# Altium project NB3000AL.PRJPCB (part 2 of 3)

## Sheet FPGA_NonIO.SchDoc: User FPGA Pwr and Programming
size A3; Organization: Altium Limited.; Address1: Level 3, 12a Rodborough Rd; Address2: Frenchs Forest 2086; Address3: NSW; Address4: AUSTRALIA; DocumentNumber: 8; SheetNumber: 9; SheetTotal: 78
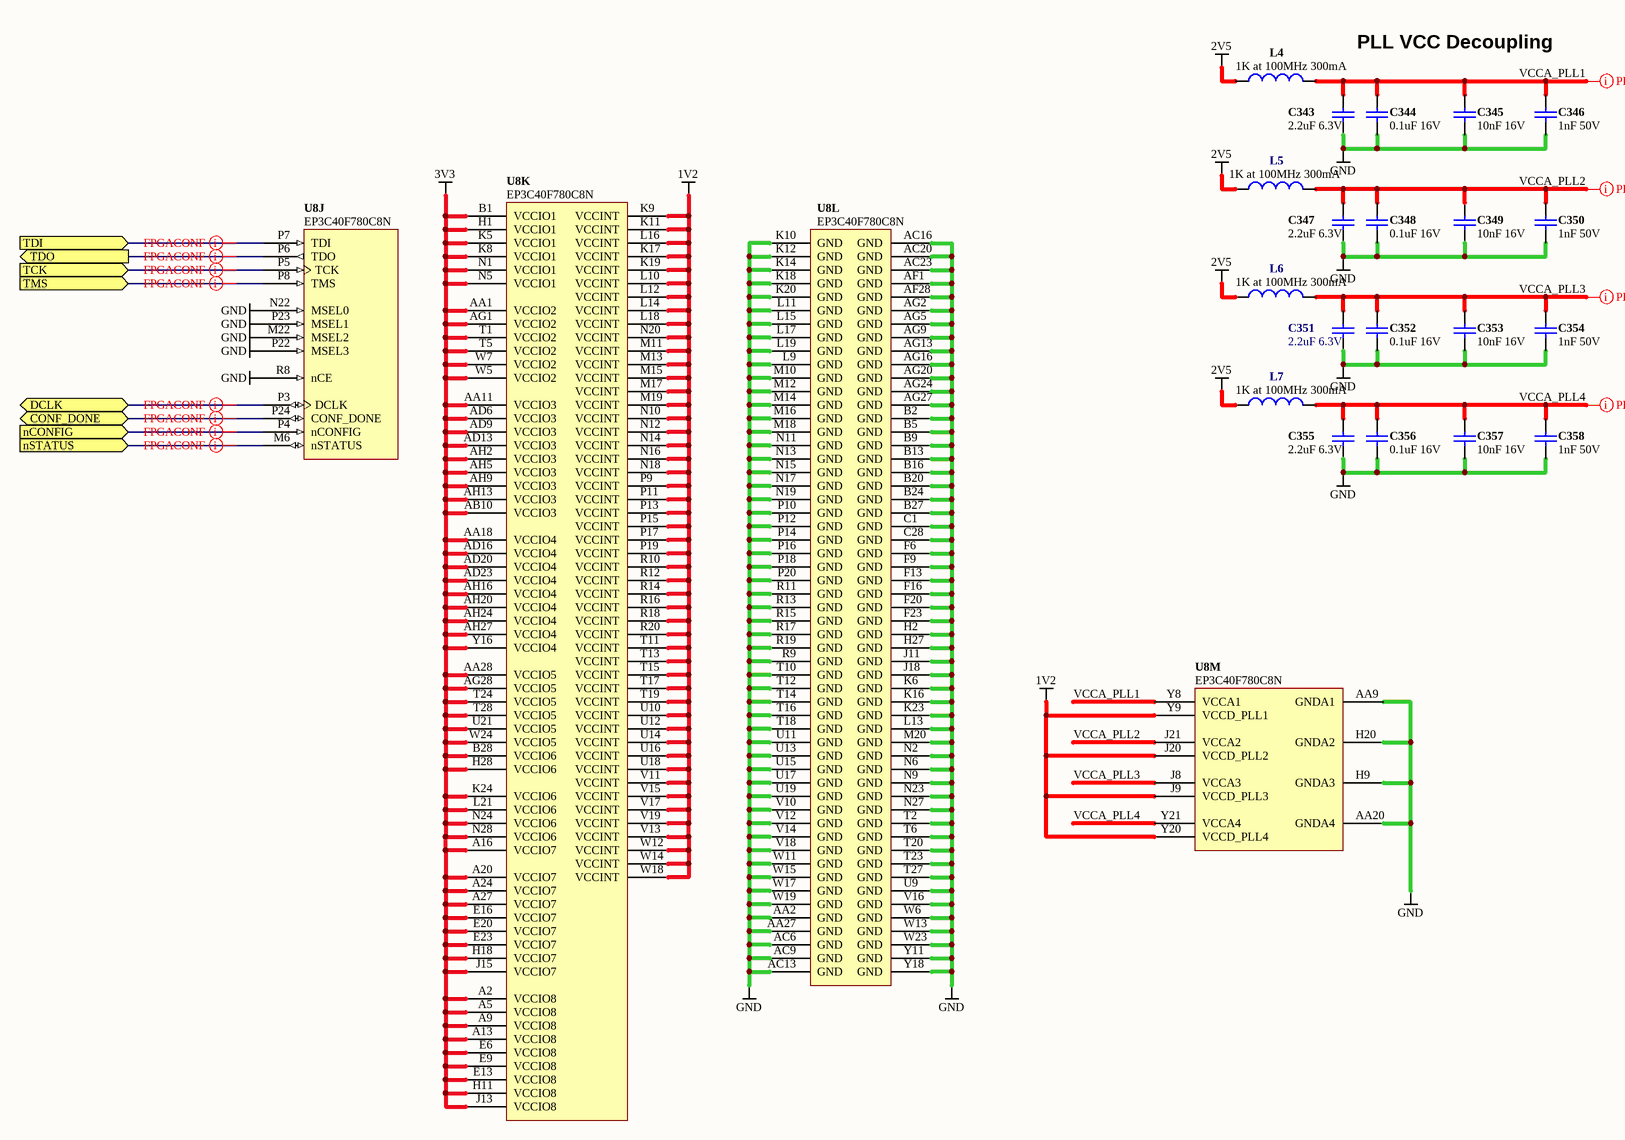
[diagram p10: FPGA_NonIO.SchDoc]

### Parts
(Parts that share a designator on the sheet are numbered #1, #2 ... from top to bottom, then left to right.)
C343#1  2.2uF 6.3V  [CAPC1005-STAR]
C344#1  0.1uF 16V  [CAPC1005-STAR]
C345#1  10nF 16V  [CAPC1005-STAR]
C346  1nF 50V  [CAPC1005-STAR]
C347  2.2uF 6.3V  [CAPC1005-STAR]
C348  0.1uF 16V  [CAPC1005-STAR]
C349  10nF 16V  [CAPC1005-STAR]
C350  1nF 50V  [CAPC1005-STAR]
C351  2.2uF 6.3V  [CAPC1005-STAR]
C352  0.1uF 16V  [CAPC1005-STAR]
C353  10nF 16V  [CAPC1005-STAR]
C354  1nF 50V  [CAPC1005-STAR]
C355  2.2uF 6.3V  [CAPC1005-STAR]
C356  0.1uF 16V  [CAPC1005-STAR]
C357  10nF 16V  [CAPC1005-STAR]
C358  1nF 50V  [CAPC1005-STAR]
L4  1K at 100MHz 300mA  [INDC1005]
L5  1K at 100MHz 300mA  [INDC1005]
L6  1K at 100MHz 300mA  [INDC1005]
L7  1K at 100MHz 300mA  [INDC1005]
U8  EP3C40F780C8N  [FBGA780-2]  (parts J,K,L,M of 13)

### Ports
CONF_DONE (bidir), DCLK (bidir), nCONFIG (in), nSTATUS (in), TCK (in), TDI (in), TDO (out), TMS (in)

### Nets
1V2: U8.J9(VCCD_PLL3) U8.J20(VCCD_PLL2) U8.K9(VCCINT) U8.K11(VCCINT) U8.K17(VCCINT) U8.K19(VCCINT) U8.L10(VCCINT) U8.L12(VCCINT) U8.L14(VCCINT) U8.L16(VCCINT) U8.L18(VCCINT) U8.M11(VCCINT) U8.M13(VCCINT) U8.M15(VCCINT) U8.M17(VCCINT) U8.M19(VCCINT) U8.N10(VCCINT) U8.N12(VCCINT) U8.N14(VCCINT) U8.N16(VCCINT) U8.N18(VCCINT) U8.N20(VCCINT) U8.P9(VCCINT) U8.P11(VCCINT) U8.P13(VCCINT) U8.P15(VCCINT) U8.P17(VCCINT) U8.P19(VCCINT) U8.R10(VCCINT) U8.R12(VCCINT) U8.R14(VCCINT) U8.R16(VCCINT) U8.R18(VCCINT) U8.R20(VCCINT) U8.T11(VCCINT) U8.T13(VCCINT) U8.T15(VCCINT) U8.T17(VCCINT) U8.T19(VCCINT) U8.U10(VCCINT) U8.U12(VCCINT) U8.U14(VCCINT) U8.U16(VCCINT) U8.U18(VCCINT) U8.V11(VCCINT) U8.V13(VCCINT) U8.V15(VCCINT) U8.V17(VCCINT) U8.V19(VCCINT) U8.W12(VCCINT) U8.W14(VCCINT) U8.W18(VCCINT) U8.Y9(VCCD_PLL1) U8.Y20(VCCD_PLL4)
2V5: L4.1 L5.1 L6.1 L7.1
3V3: U8.A2(VCCIO8) U8.A5(VCCIO8) U8.A9(VCCIO8) U8.A13(VCCIO8) U8.A16(VCCIO7) U8.A20(VCCIO7) U8.A24(VCCIO7) U8.A27(VCCIO7) U8.AA1(VCCIO2) U8.AA11(VCCIO3) U8.AA18(VCCIO4) U8.AA28(VCCIO5) U8.AB10(VCCIO3) U8.AD6(VCCIO3) U8.AD9(VCCIO3) U8.AD13(VCCIO3) U8.AD16(VCCIO4) U8.AD20(VCCIO4) U8.AD23(VCCIO4) U8.AG1(VCCIO2) U8.AG28(VCCIO5) U8.AH2(VCCIO3) U8.AH5(VCCIO3) U8.AH9(VCCIO3) U8.AH13(VCCIO3) U8.AH16(VCCIO4) U8.AH20(VCCIO4) U8.AH24(VCCIO4) U8.AH27(VCCIO4) U8.B1(VCCIO1) U8.B28(VCCIO6) U8.E6(VCCIO8) U8.E9(VCCIO8) U8.E13(VCCIO8) U8.E16(VCCIO7) U8.E20(VCCIO7) U8.E23(VCCIO7) U8.H1(VCCIO1) U8.H11(VCCIO8) U8.H18(VCCIO7) U8.H28(VCCIO6) U8.J13(VCCIO8) U8.J15(VCCIO7) U8.K5(VCCIO1) U8.K8(VCCIO1) U8.K24(VCCIO6) U8.L21(VCCIO6) U8.N1(VCCIO1) U8.N5(VCCIO1) U8.N24(VCCIO6) U8.N28(VCCIO6) U8.T1(VCCIO2) U8.T5(VCCIO2) U8.T24(VCCIO5) U8.T28(VCCIO5) U8.U21(VCCIO5) U8.W5(VCCIO2) U8.W7(VCCIO2) U8.W24(VCCIO5) U8.Y16(VCCIO4)
GND: C343#1.2 C344#1.2 C345#1.2 C346.2 C347.2 C348.2 C349.2 C350.2 C351.2 C352.2 C353.2 C354.2 C355.2 C356.2 C357.2 C358.2 U8.AA2(GND) U8.AA9(GNDA1) U8.AA20(GNDA4) U8.AA27(GND) U8.AC6(GND) U8.AC9(GND) U8.AC13(GND) U8.AC16(GND) U8.AC20(GND) U8.AC23(GND) U8.AF1(GND) U8.AF28(GND) U8.AG2(GND) U8.AG5(GND) U8.AG9(GND) U8.AG13(GND) U8.AG16(GND) U8.AG20(GND) U8.AG24(GND) U8.AG27(GND) U8.B2(GND) U8.B5(GND) U8.B9(GND) U8.B13(GND) U8.B16(GND) U8.B20(GND) U8.B24(GND) U8.B27(GND) U8.C1(GND) U8.C28(GND) U8.F6(GND) U8.F9(GND) U8.F13(GND) U8.F16(GND) U8.F20(GND) U8.F23(GND) U8.H2(GND) U8.H9(GNDA3) U8.H20(GNDA2) U8.H27(GND) U8.J11(GND) U8.J18(GND) U8.K6(GND) U8.K10(GND) U8.K12(GND) U8.K14(GND) U8.K16(GND) U8.K18(GND) U8.K20(GND) U8.K23(GND) U8.L9(GND) U8.L11(GND) U8.L13(GND) U8.L15(GND) U8.L17(GND) U8.L19(GND) U8.M10(GND) U8.M12(GND) U8.M14(GND) U8.M16(GND) U8.M18(GND) U8.M20(GND) U8.M22(MSEL2) U8.N2(GND) U8.N6(GND) U8.N9(GND) U8.N11(GND) U8.N13(GND) U8.N15(GND) U8.N17(GND) U8.N19(GND) U8.N22(MSEL0) U8.N23(GND) U8.N27(GND) U8.P10(GND) U8.P12(GND) U8.P14(GND) U8.P16(GND) U8.P18(GND) U8.P20(GND) U8.P22(MSEL3) U8.P23(MSEL1) U8.R8(nCE) U8.R9(GND) U8.R11(GND) U8.R13(GND) U8.R15(GND) U8.R17(GND) U8.R19(GND) U8.T2(GND) U8.T6(GND) U8.T10(GND) U8.T12(GND) U8.T14(GND) U8.T16(GND) U8.T18(GND) U8.T20(GND) U8.T23(GND) U8.T27(GND) U8.U9(GND) U8.U11(GND) U8.U13(GND) U8.U15(GND) U8.U17(GND) U8.U19(GND) U8.V10(GND) U8.V12(GND) U8.V14(GND) U8.V16(GND) U8.V18(GND) U8.W6(GND) U8.W11(GND) U8.W13(GND) U8.W15(GND) U8.W17(GND) U8.W19(GND) U8.W23(GND) U8.Y11(GND) U8.Y18(GND)
CONF_DONE: U8.P24(CONF_DONE) ; port CONF_DONE
DCLK: U8.P3(DCLK) ; port DCLK
nCONFIG: U8.P4(nCONFIG) ; port nCONFIG
nSTATUS: U8.M6(nSTATUS) ; port nSTATUS
TCK: U8.P5(TCK) ; port TCK
TDI: U8.P7(TDI) ; port TDI
TDO: U8.P6(TDO) ; port TDO
TMS: U8.P8(TMS) ; port TMS
VCCA_PLL1: C343#1.1 C344#1.1 C345#1.1 C346.1 L4.2 U8.Y8(VCCA1)
VCCA_PLL2: C347.1 C348.1 C349.1 C350.1 L5.2 U8.J21(VCCA2)
VCCA_PLL3: C351.1 C352.1 C353.1 C354.1 L6.2 U8.J8(VCCA3)
VCCA_PLL4: C355.1 C356.1 C357.1 C358.1 L7.2 U8.Y21(VCCA4)

### Layout directives
net class FPGACONF: CONF_DONE, DCLK, nCONFIG, nSTATUS, TCK, TDI, TDO, TMS
net class PLL: VCCA_PLL1, VCCA_PLL2, VCCA_PLL3, VCCA_PLL4

### Notes on the sheet
- PLL VCC Decoupling
- Sheet Title
- Project Title
- Size:
- Date:
- A3
- Assy:
- Time:
- Revision:
- Sheet
- of
- File:

### Library data of the parts
C343#1 C347 C351 C355 = D-101-0112: Capacitor, Ceramic, 2.2uF 10% 6.3V 0402 (1005) X5R; Polarity: Non-Polarized; Tolerance: 20 %; Capacitance: 2.2 uF; Dielectric: X5R; Mounting Technology: Surface Mount; Rated Voltage: 6.3 V; Status: Unreleased; Technology: None; Category: Capacitor
C344#1 C348 C352 C356 = D-101-0080: Capacitor, Ceramic, 0.1uF 10% 16V 0402 (1005) X7R; Polarity: Non-Polarized; Capacitance: 0.1 uF; Dielectric: X7R; Mounting Technology: Surface Mount; Rated Voltage: 16 V; Status: Production; Technology: Ceramic; Tolerance: 10 %; Category: Capacitor
C345#1 C349 C353 C357 = D-101-0077: Capacitor, Ceramic, 10nF 10% 16V 0402 (1005) X7R; Polarity: Non-Polarized; Capacitance: 10 nF; Dielectric: X7R; Mounting Technology: Surface Mount; Rated Voltage: 16 V; Status: Production; Technology: Ceramic; Tolerance: 10 %; Category: Capacitor
C346 C350 C354 C358 = D-101-0030: Capacitor, Ceramic, 1nF 10% 50V 0402 (1005) X7R; Polarity: Non-Polarized; Capacitance: 1 nF; Dielectric: X7R; Mounting Technology: Surface Mount; Rated Voltage: 50 V; Status: Production; Technology: Ceramic; Tolerance: 10 %; Category: Capacitor
L4-L7 = D-102-0026: Inductor, Ferrite Bead 1K@100MHz 300mA 0402 BK1005HS102-T; Inductance: nH; Max Input Current: 300 mA; Mounting Technology: Surface Mount; Status: Production; Category: Inductor
U8 = D-241-0023: FPGA, Altera Cyclone3-40 F780; Supply Voltage: mV; Mounting Technology: Surface Mount; Status: Unreleased; Technology: None; Category: IC-FPGA

## Sheet PULLDNx3.SCHDOC: Visual Indicators Top
size A4; DocumentNumber: 10; SheetNumber: 11; SheetTotal: 78
Used 10 times, as channels PULLDOWN, PULLDOWN, PULLDOWN, PULLDOWN, PULLDOWN, PULLDOWN, PULLDOWN, PULLDOWN, PULLDOWN, PULLDOWN. Parts and nets are listed once, with the designators drawn on the sheet.
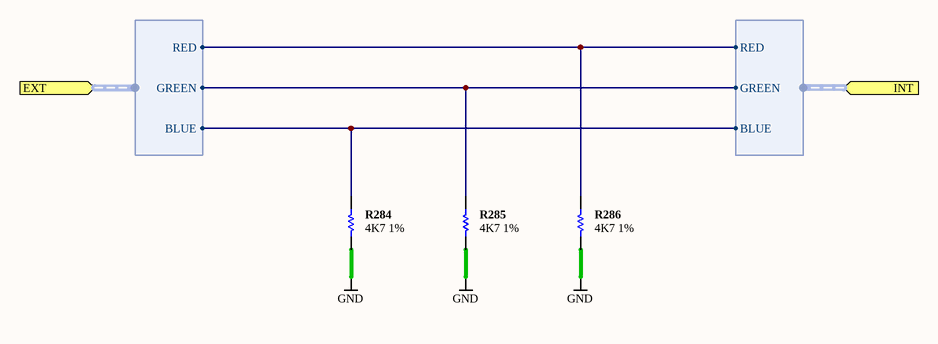
[diagram p11: PULLDNx3.SCHDOC]

### Parts
R284  4K7 1%  [RESC1005-STAR]
R285  4K7 1%  [RESC1005-STAR]
R286  4K7 1%  [RESC1005-STAR]

### Ports
EXT (harness RGB_LED), INT (harness RGB_LED)

### Harnesses
RGB_LED: GREEN, RED, BLUE

### Nets
GND: R284.1 R285.1 R286.1
NetR284_2: R284.2 ; port EXT.BLUE, port INT.BLUE
NetR285_2: R285.2 ; port EXT.GREEN, port INT.GREEN
NetR286_2: R286.2 ; port EXT.RED, port INT.RED

### Channels
PULLDOWN: designators end in A
PULLDOWN: designators end in B
PULLDOWN: designators end in C
PULLDOWN: designators end in D
PULLDOWN: designators end in E
PULLDOWN: designators end in F
PULLDOWN: designators end in G
PULLDOWN: designators end in H
PULLDOWN: designators end in I
PULLDOWN: designators end in J

### Notes on the sheet
- Sheet Title
- Project Title
- Size:
- Date:
- A4
- Assy:
- Time:
- Revision:
- Sheet
- of
- File:

### Library data of the parts
R284-R286 = D-100-0088: Resistor, 4K7 1% 0402 (1005); Power Rating: 63 mW; Resistance: 4.7 K; Category: Resistor; Mounting Technology: Surface Mount; Status: Production; Tolerance: 1 %

## Sheet LED_RGB_SMDx8.SCHDOC: Visual Indicators Top
size A4; DocumentNumber: 10; SheetNumber: 11; SheetTotal: 78
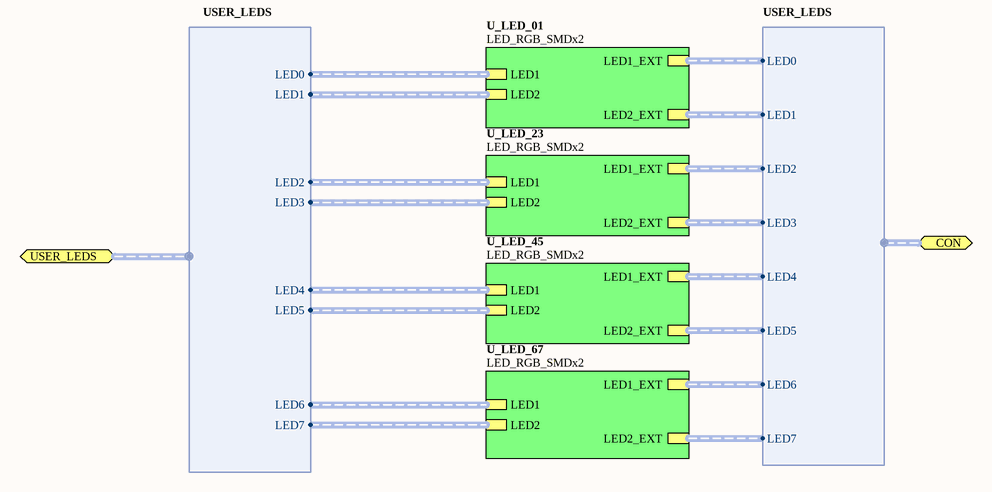
[diagram p12: LED_RGB_SMDx8.SCHDOC]

### Sub-sheets
U_LED_01 = LED_RGB_SMDx2: LED1 (harness RGB_LED), LED2 (harness RGB_LED), LED1_EXT (harness RGB_LED), LED2_EXT (harness RGB_LED)
U_LED_23 = LED_RGB_SMDx2: LED1 (harness RGB_LED), LED2 (harness RGB_LED), LED1_EXT (harness RGB_LED), LED2_EXT (harness RGB_LED)
U_LED_45 = LED_RGB_SMDx2: LED1 (harness RGB_LED), LED2 (harness RGB_LED), LED1_EXT (harness RGB_LED), LED2_EXT (harness RGB_LED)
U_LED_67 = LED_RGB_SMDx2: LED1 (harness RGB_LED), LED2 (harness RGB_LED), LED1_EXT (harness RGB_LED), LED2_EXT (harness RGB_LED)

### Ports
CON (harness USER_LEDS), USER_LEDS (harness USER_LEDS)

### Harnesses
USER_LEDS: LED0, LED1, LED2, LED3, LED4, LED5, LED6, LED7

### Notes on the sheet
- Sheet Title
- Project Title
- Size:
- Date:
- A4
- Assy:
- Time:
- Revision:
- Sheet
- of
- File:

## Sheet LED_RGB_SMDx2.SCHDOC: Visual Indicators
size A4; DocumentNumber: 1; SheetNumber: 2; SheetTotal: 77
Used 4 times, as channels U_LED_01, U_LED_23, U_LED_45, U_LED_67. Parts and nets are listed once, with the designators drawn on the sheet.
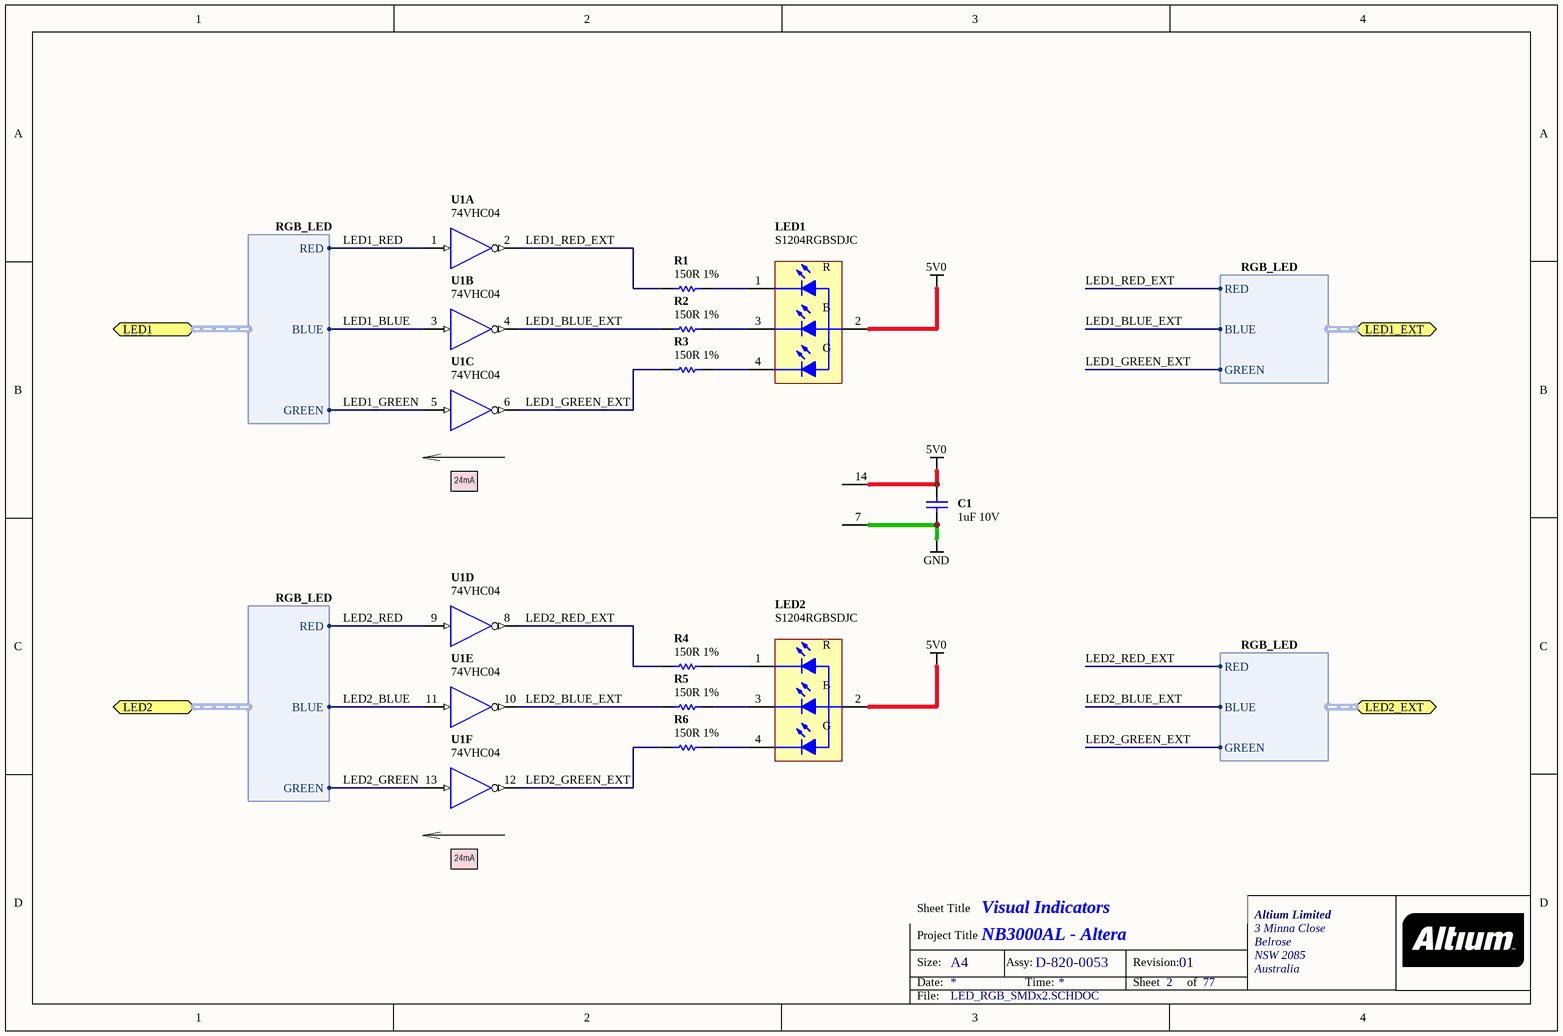
[diagram p13: LED_RGB_SMDx2.SCHDOC]

### Parts
C1  1uF 10V  [CAPC1005-STAR]
LED1  S1204RGBSDJC  [S1204RGBSDJC]
LED2  S1204RGBSDJC  [S1204RGBSDJC]
R1  150R 1%  [RESC1005-STAR]
R2  150R 1%  [RESC1005-STAR]
R3  150R 1%  [RESC1005-STAR]
R4  150R 1%  [RESC1005-STAR]
R5  150R 1%  [RESC1005-STAR]
R6  150R 1%  [RESC1005-STAR]
U1  74VHC04  [TSSOP14]  (parts A,B,C,D,E,F of 6)

### Ports
LED1 (harness RGB_LED), LED1_EXT (harness RGB_LED), LED2 (harness RGB_LED), LED2_EXT (harness RGB_LED)

### Harnesses
RGB_LED: GREEN, RED, BLUE

### Nets
5V0: C1.2 LED1.2(A2) LED2.2(A2) U1.14(VCC)
GND: C1.1 U1.7(GND)
LED1_BLUE: U1.3(A) ; port LED1.BLUE
LED1_BLUE_EXT: R2.2 U1.4(Y) ; port LED1_EXT.BLUE
LED1_GREEN: U1.5(A) ; port LED1.GREEN
LED1_GREEN_EXT: R3.2 U1.6(Y) ; port LED1_EXT.GREEN
LED1_RED: U1.1(A) ; port LED1.RED
LED1_RED_EXT: R1.2 U1.2(Y) ; port LED1_EXT.RED
LED2_BLUE: U1.11(A) ; port LED2.BLUE
LED2_BLUE_EXT: R5.2 U1.10(Y) ; port LED2_EXT.BLUE
LED2_GREEN: U1.13(A) ; port LED2.GREEN
LED2_GREEN_EXT: R6.2 U1.12(Y) ; port LED2_EXT.GREEN
LED2_RED: U1.9(A) ; port LED2.RED
LED2_RED_EXT: R4.2 U1.8(Y) ; port LED2_EXT.RED
NetLED1_1: LED1.1(R) R1.1
NetLED1_3: LED1.3(B) R2.1
NetLED1_4: LED1.4(G) R3.1
NetLED2_1: LED2.1(R) R4.1
NetLED2_3: LED2.3(B) R5.1
NetLED2_4: LED2.4(G) R6.1

### Channels
U_LED_01: designators end in A
U_LED_23: designators end in B
U_LED_45: designators end in C
U_LED_67: designators end in D

### Notes on the sheet
- (near U1) 24mA
- 24mA
- Sheet Title
- Project Title
- Size:
- Date:
- A4
- Assy:
- Time:
- Revision:
- Sheet
- of
- File:

### Library data of the parts
C1 = D-101-0131: Capacitor, Ceramic, 1uF 10% 10V 0402 (1005) X5R; Polarity: Non-Polarized; Category: Capacitor; Capacitance: 1 uF; Dielectric: X5R; Mounting Technology: Surface Mount; Rated Voltage: 10 V; Status: Unreleased; Technology: None; Tolerance: 10 %
LED1 LED2 = D-153-0020: SASEN LED, RGB, SMD; Brightness: mcd; Peak Wave Length: nm; Color: RGB; Mounting Technology: Surface Mount; Status: Production; Category: LED
R1-R6 = D-100-0005: Resistor, 150R 1% 0402 (1005); Power Rating: 63 mW; Category: Resistor; Mounting Technology: Surface Mount; Resistance: 150 R; Status: Unreleased; Tolerance: 1 %
U1 = D-205-0004: HEX Inverter; Mounting Technology: Surface Mount; Status: Unreleased; Category: IC-Logic

## Sheet PWJACK+SWITCH.SchDoc: Power Jack & Switch
size A4; Organization: Altium Limited.; Address1: Level 3, 12a Rodborough Rd; Address2: Frenchs Forest 2086; Address3: NSW; Address4: AUSTRALIA; DocumentNumber: 20; Revision: 6; SheetNumber: 21; SheetTotal: 78
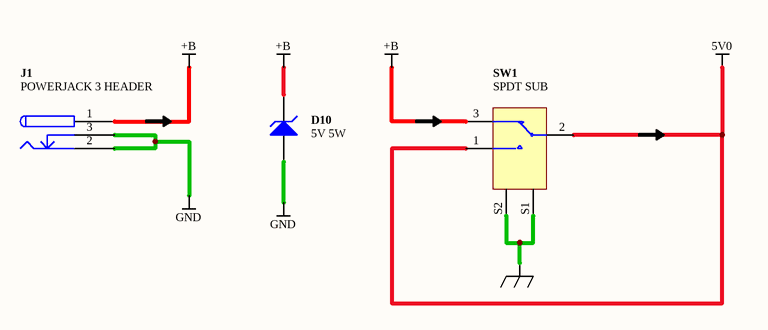
[diagram p14: PWJACK+SWITCH.SchDoc]

### Parts
(Parts that share a designator on the sheet are numbered #1, #2 ... from top to bottom, then left to right.)
D10  5V 5W  [DIOM8059]
J1#2  POWERJACK 3 HEADER  [KLD-0202]
SW1  SPDT SUB  [T8019L-TNQ]

### Nets
5V0: SW1.1 SW1.2
+B: D10.2(K) J1#2.1 SW1.3
GND: D10.1(A) J1#2.2 J1#2.3
SHIELD: SW1.S1 SW1.S2

### Notes on the sheet
- Sheet Title
- Project Title
- Size:
- Date:
- A4
- Assy:
- Time:
- Revision:
- Sheet
- of
- File:

### Library data of the parts
D10 = D-150-0001: Zener Diode, 5V 5W; Max Forward Current: mA; Rated Voltage: mV; Category: Diode-Zener; Mounting Technology: Surface Mount; Status: Production
J1#2 = D-300-0007: Connector, 3 Conductor Power Jack 2 break 2 aux contacts; ClassName: COMP_5V0; Category: Connector; Connector type: POWERJACK 3 HEADER; Status: Production
SW1 = D-301-0000: Switch, SPDT Subminiature Toggle; ClassName: COMP_5V0; Category: Switch; Status: Production

## Sheet HOST_JTAG.SchDoc: Local MCU Debug Connector
size A4; DocumentNumber: 24; SheetNumber: 25; SheetTotal: 78
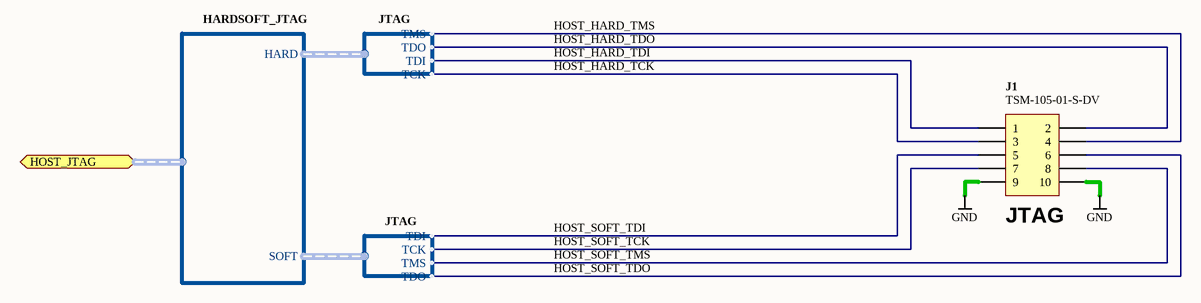
[diagram p15: HOST_JTAG.SchDoc]

### Parts
(Parts that share a designator on the sheet are numbered #1, #2 ... from top to bottom, then left to right.)
J1#3  TSM-105-01-S-DV  [TSM-105-01-DV]

### Ports
HOST_JTAG (harness HARDSOFT_JTAG)

### Harnesses
JTAG: TMS, TDO, TDI, TCK
HARDSOFT_JTAG: HARD, SOFT

### Nets
GND: J1#3.9 J1#3.10
HOST_HARD_TCK: J1#3.3 ; harness JTAG.TCK
HOST_HARD_TDI: J1#3.1 ; harness JTAG.TDI
HOST_HARD_TDO: J1#3.2 ; harness JTAG.TDO
HOST_HARD_TMS: J1#3.4 ; harness JTAG.TMS
HOST_SOFT_TCK: J1#3.7 ; harness JTAG.TCK
HOST_SOFT_TDI: J1#3.5 ; harness JTAG.TDI
HOST_SOFT_TDO: J1#3.6 ; harness JTAG.TDO
HOST_SOFT_TMS: J1#3.8 ; harness JTAG.TMS

### Notes on the sheet
- (near J1#3) JTAG
- Sheet Title
- Project Title
- Size:
- Date:
- A4
- Assy:
- Time:
- Revision:
- Sheet
- of
- File:

### Library data of the parts
J1#3 = D-300-0076: Non-Boxed Header IDC, 2 X 5 Pin SMD; Connector type: Boxed; Max Current: mA; Category: Connector; Mounting Technology: Surface Mount; Status: Unreleased

## Sheet USERPWR.SchDoc: USER IO Power Loopback
size A4; Organization: Altium Limited.
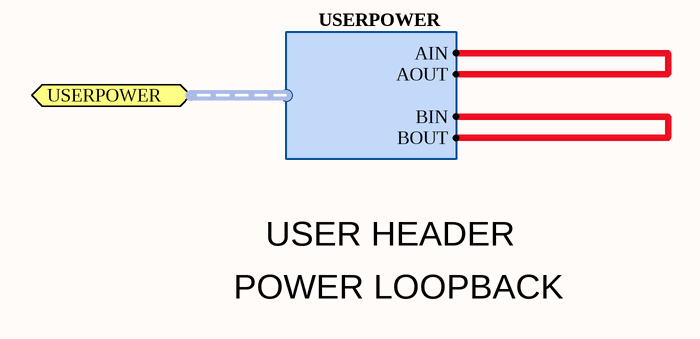
[diagram p16: USERPWR.SchDoc]

### Ports
USERPOWER (harness USERPOWER)

### Harnesses
USERPOWER: AIN, BIN, AOUT, BOUT

### Nets
(unnamed): port USERPOWER.AIN, port USERPOWER.AOUT
(unnamed): port USERPOWER.BIN, port USERPOWER.BOUT

### Notes on the sheet
- POWER LOOPBACK
- USER HEADER
- Sheet Title
- Project Title
- Size:
- Date:
- A4
- Assy:
- Time:
- Revision:
- Sheet
- of
- File:

## Sheet Host_FPGA.SchDoc: Host Controller - Altera - EP3C10
size A2; Organization: Altium Limited.; Revision: 6; PageSetup: Record=PageOptions|CenterHorizontal=True|CenterVertical=True|PrintScale=0.47|XCorrection=1.00|YCorrection=1.00|PrintKind=0|BorderSize=5000000|LeftOffset=0|BottomOffset=0|Orientation=2|PaperLength=1000|PaperWidth=1000|Scale=100|PaperSource=7|PrintQuality=1200|MediaType=1|DitherType=10|PaperKind=A4 (210 x 297 mm)|PrintScaleMode=1
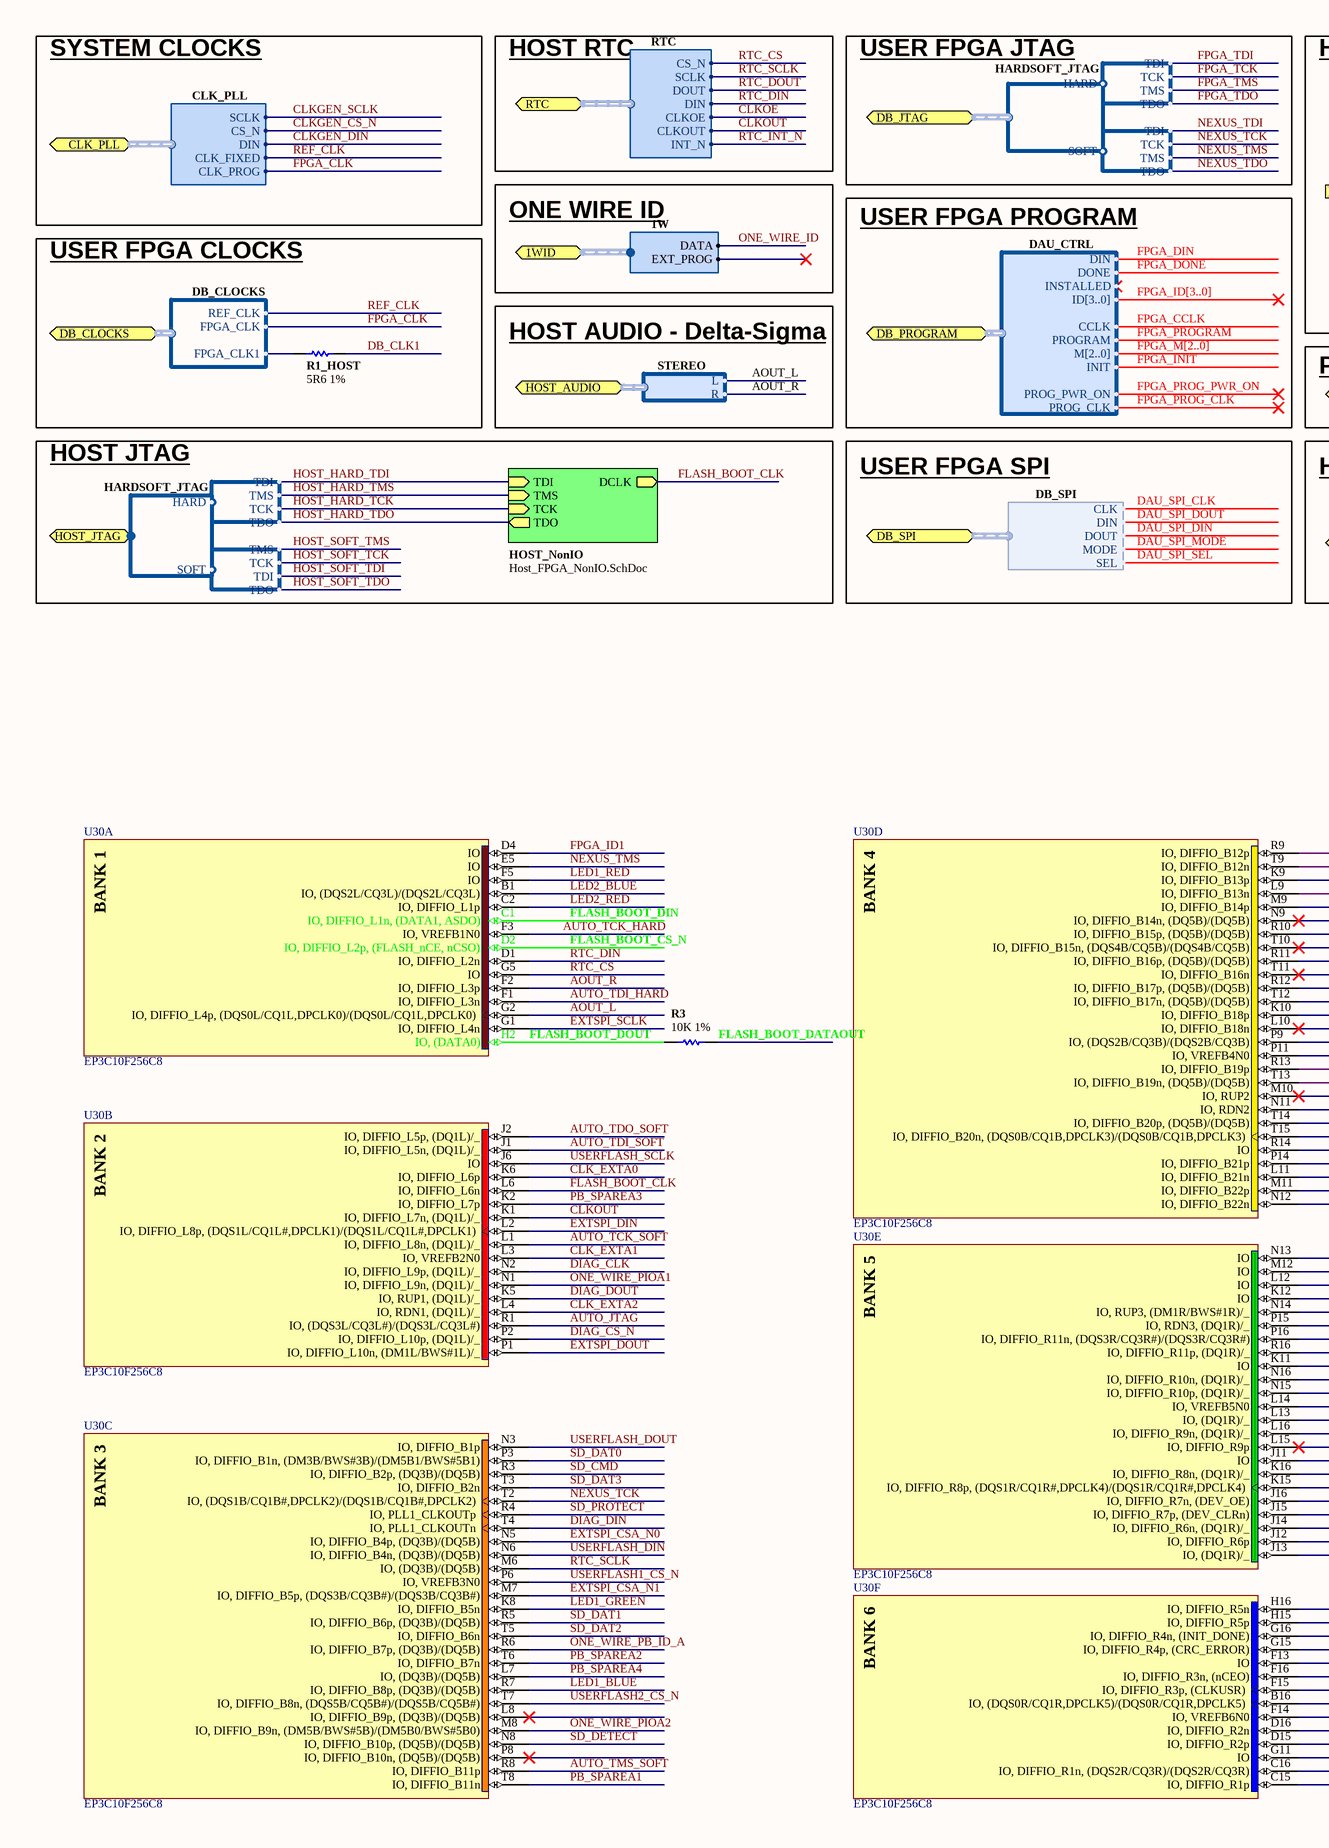
[diagram p17: Host_FPGA.SchDoc, left]
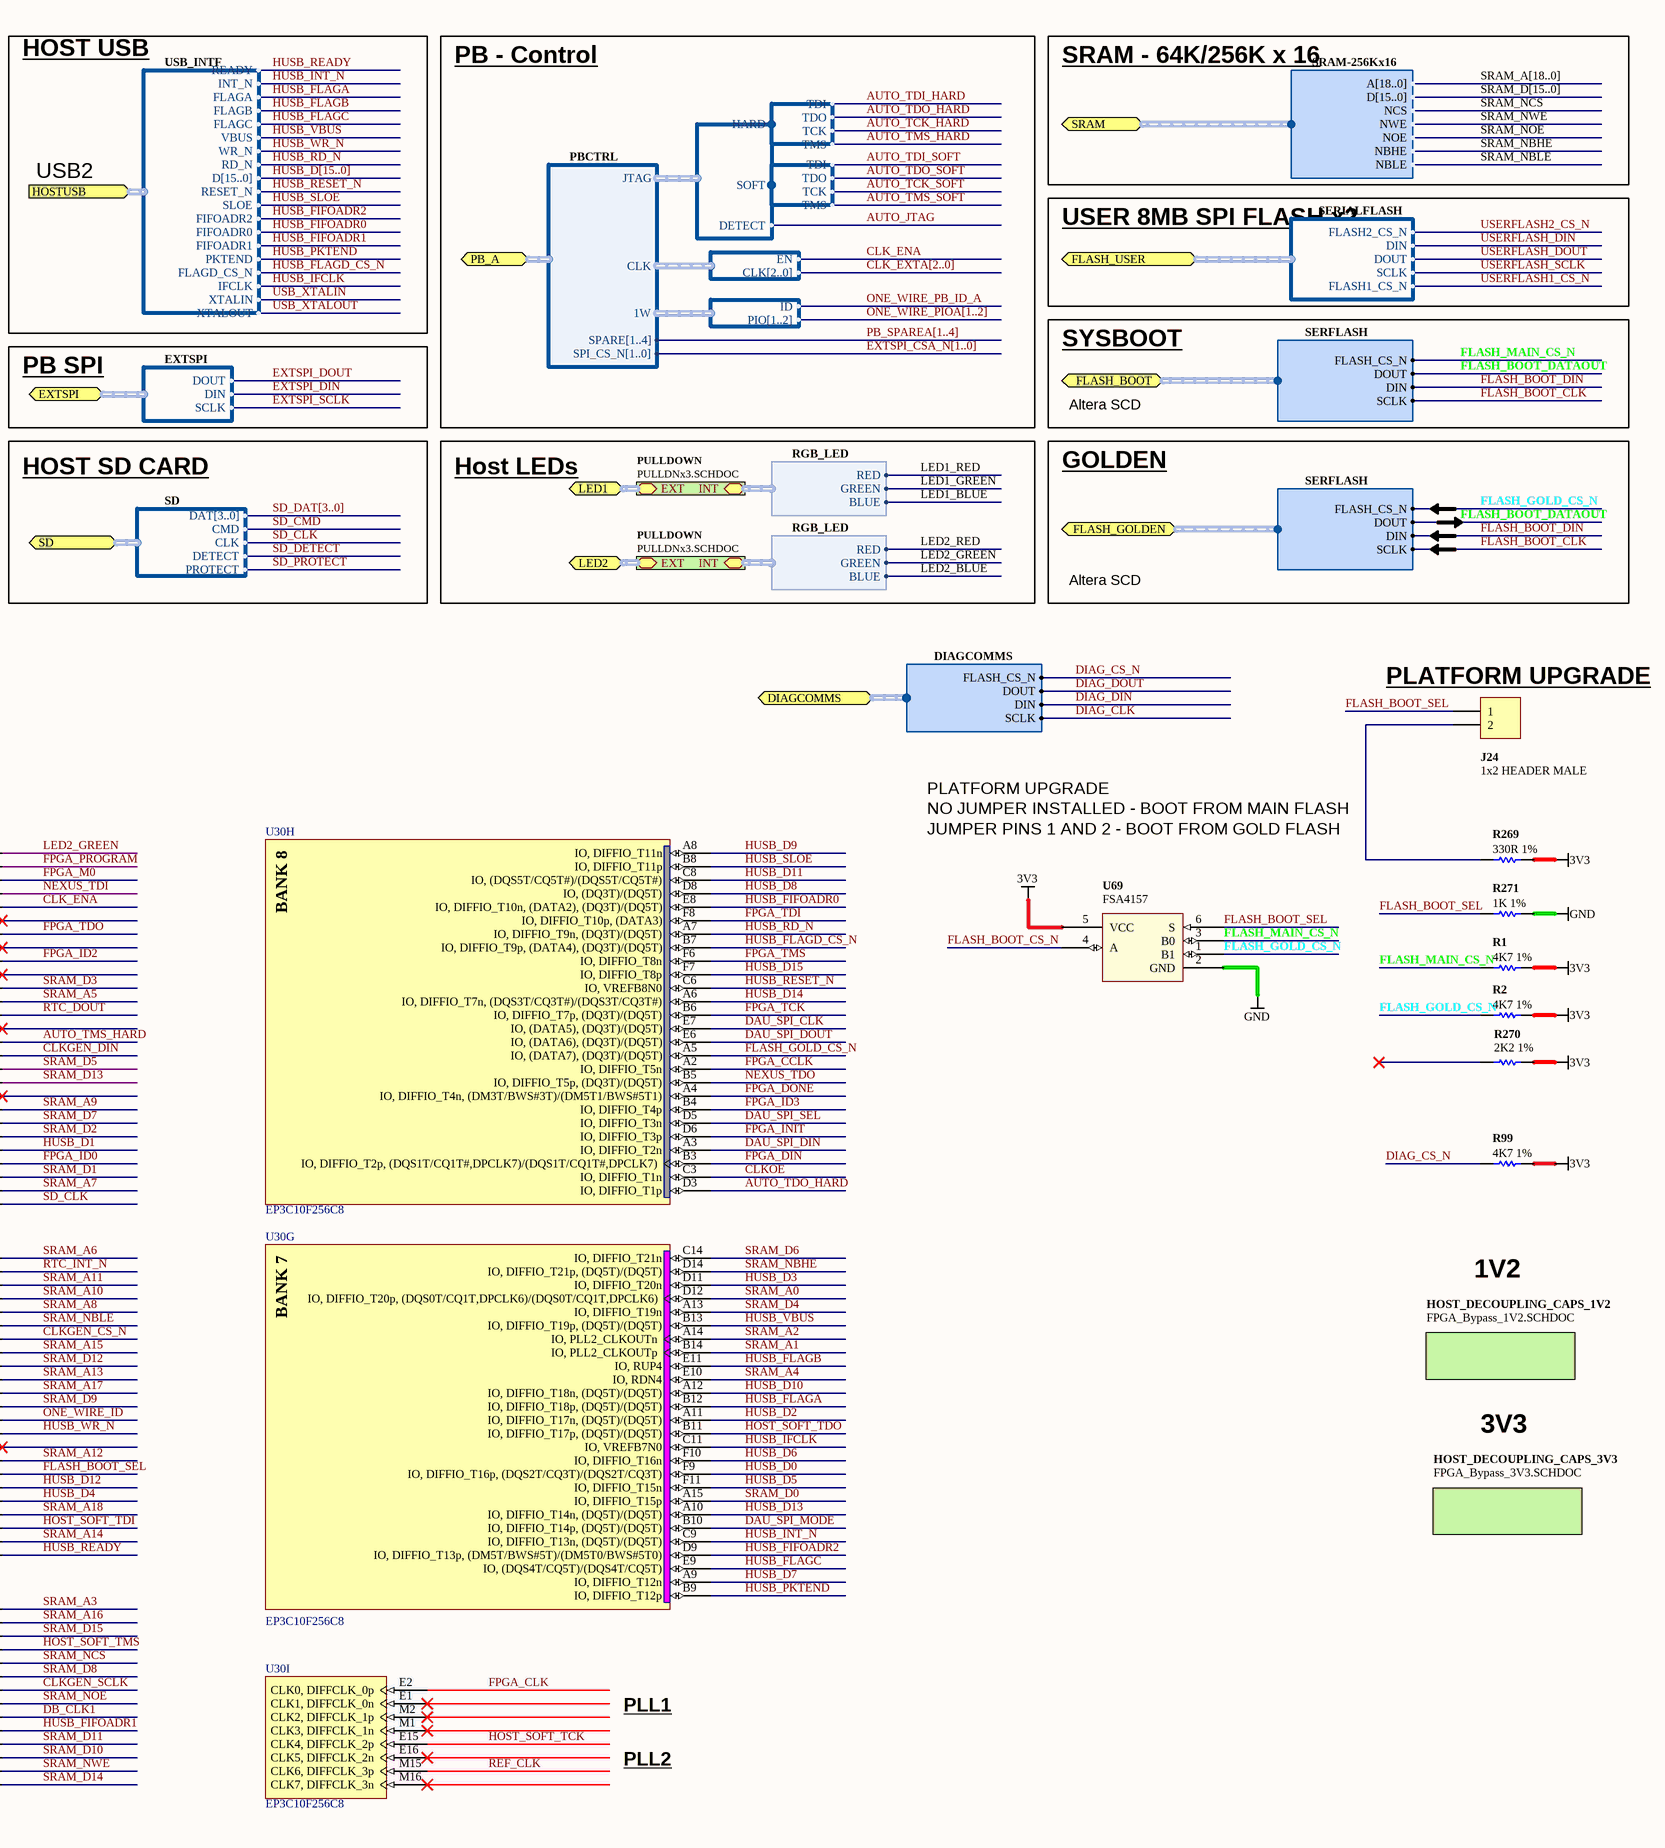
[diagram p18: Host_FPGA.SchDoc, right]

### Parts
(Parts that share a designator on the sheet are numbered #1, #2 ... from top to bottom, then left to right.)
J24  1x2 HEADER MALE  [HDR1X2]
R1#2  4K7 1%  [RESC1005-STAR]
R1_HOST  5R6 1%  [RESC1005-STAR]
R2#2  4K7 1%  [RESC1005-STAR]
R3#2  10K 1%  [RESC1005-STAR]
R99  4K7 1%  [RESC1005-STAR]
R269  330R 1%  [RESC1005-STAR]
R270  2K2 1%  [RESC1005-STAR]
R271  1K 1%  [RESC1005-STAR]
U30  EP3C10F256C8  [FBGA256-2]  (parts A,B,C,D,E,F,G,H,I of 13)
U69  FSA4157  [SC70_6L]

### Blocks framed on the sheet
USER FPGA CLOCKS: R1_HOST

### Sub-sheets
HOST_DECOUPLING_CAPS_1V2 = FPGA_Bypass_1V2.SCHDOC (file not in this document): no entries
HOST_DECOUPLING_CAPS_3V3 = FPGA_Bypass_3V3.SCHDOC: no entries
HOST_NonIO = Host_FPGA_NonIO.SchDoc: TMS (in), TCK (in), TDI (in), TDO (out), DCLK (out)
PULLDOWN = PULLDNx3.SCHDOC: EXT, INT (harness RGB_LED)
PULLDOWN = PULLDNx3.SCHDOC: EXT, INT (harness RGB_LED)

### Ports
1WID (harness 1W), CLK_PLL (harness CLK_PLL), DB_CLOCKS (harness DB_CLOCKS), DB_JTAG (harness HARDSOFT_JTAG), DB_PROGRAM (harness DAU_CTRL), DB_SPI (harness DB_SPI), DIAGCOMMS (harness DIAGCOMMS), EXTSPI (harness EXTSPI), FLASH_BOOT (harness SERFLASH), FLASH_GOLDEN (harness SERFLASH), FLASH_USER (harness SERIALFLASH), HOST_AUDIO (harness STEREO), HOST_JTAG (harness HARDSOFT_JTAG), HOSTUSB (harness USB_INTF), LED1 (harness RGB_LED), LED2 (harness RGB_LED), PB_A (harness PBCTRL), RTC (harness RTC), SD (harness SD), SRAM (harness SRAM-256Kx16)

### Harnesses
SERIALFLASH: FLASH2_CS_N, DIN, DOUT, SCLK, FLASH1_CS_N
JTAG: TMS, TDO, TDI, TCK
HARDSOFT_JTAG: HARD, SOFT
SD: DAT[3..0], CMD, CLK, DETECT, PROTECT
STEREO: L, R
RTC: CS_N, DIN, DOUT, INT_N, SCLK, CLKOUT, CLKOE
DAU_CTRL: DIN, DONE, INSTALLED, ID[3..0], CCLK, PROGRAM, M[2..0], INIT, PROG_PWR_ON, PROG_CLK
1W: DATA, EXT_PROG
CLK_PLL: CLK_FIXED, CLK_PROG, CS_N, DIN, SCLK
SRAM-256Kx16: A[18..0], D[15..0], NCS, NWE, NOE, NBHE, NBLE
RGB_LED: GREEN, RED, BLUE
DB_CLOCKS: REF_CLK, FPGA_CLK, FPGA_CLK1
DB_SPI: MODE, SEL, CLK, DIN, DOUT
JTAG_CONFIG: HARD, SOFT, DETECT
JTAG: TDI, TDO, TCK, TMS
GATE_CLOCKS: EN, CLK[2..0]
ONE_WIRE: ID, PIO[1..2]
PBCTRL: JTAG, CLK, 1W, SPI_CS_N[1..0], SPARE[1..4]
EXTSPI: DOUT, DIN, SCLK
SERFLASH: DIN, DOUT, SCLK, FLASH_CS_N
USB_INTF: READY, INT_N, SLOE, FIFOADR2, FIFOADR0, FIFOADR1, PKTEND, FLAGD_CS_N, FLAGA, FLAGB, FLAGC, WR_N, RD_N, D[15..0], RESET_N, IFCLK, XTALIN, VBUS, XTALOUT
DIAGCOMMS: DIN, DOUT, SCLK, FLASH_CS_N

### Nets
3V3: R1#2.2 R2#2.2 R99.2 R269.2 R270.2 U69.5(VCC)
GND: R271.2 U69.2(GND)
AOUT_L: U30.G2(IO,_DIFFIO_L4p,_(DQS0L/CQ1L,DPCLK0)/(DQS0L/CQ1L,DPCLK0)) ; port HOST_AUDIO.L
AOUT_R: U30.F2(IO,_DIFFIO_L3p) ; port HOST_AUDIO.R
AUTO_JTAG: U30.R1(IO,_(DQS3L/CQ3L#)/(DQS3L/CQ3L#)) ; harness JTAG_CONFIG.DETECT
AUTO_TCK_HARD: U30.F3(IO,_VREFB1N0) ; harness JTAG.TCK
AUTO_TCK_SOFT: U30.L1(IO,_DIFFIO_L8n,_(DQ1L)/_) ; harness JTAG.TCK
AUTO_TDI_HARD: U30.F1(IO,_DIFFIO_L3n) ; harness JTAG.TDI
AUTO_TDI_SOFT: U30.J1(IO,_DIFFIO_L5n,_(DQ1L)/_) ; harness JTAG.TDI
AUTO_TDO_HARD: U30.D3(IO,_DIFFIO_T1p) ; harness JTAG.TDO
AUTO_TDO_SOFT: U30.J2(IO,_DIFFIO_L5p,_(DQ1L)/_) ; harness JTAG.TDO
AUTO_TMS_HARD: U30.P9(IO,_(DQS2B/CQ3B)/(DQS2B/CQ3B)) ; harness JTAG.TMS
AUTO_TMS_SOFT: U30.R8(IO,_DIFFIO_B11p) ; harness JTAG.TMS
CLK_ENA: U30.M9(IO,_DIFFIO_B14p) ; harness GATE_CLOCKS.EN
CLK_EXTA0: U30.K6(IO,_DIFFIO_L6p)
CLK_EXTA1: U30.L3(IO,_VREFB2N0)
CLK_EXTA2: U30.L4(IO,_RDN1,_(DQ1L)/_)
CLKGEN_CS_N: U30.P16(IO,_DIFFIO_R11n,_(DQS3R/CQ3R#)/(DQS3R/CQ3R#)) ; port CLK_PLL.CS_N
CLKGEN_DIN: U30.P11(IO,_VREFB4N0) ; port CLK_PLL.DIN
CLKGEN_SCLK: U30.F15(IO,_DIFFIO_R3p,_(CLKUSR)) ; port CLK_PLL.SCLK
CLKOE: U30.C3(IO,_DIFFIO_T1n) ; port RTC.CLKOE
CLKOUT: U30.K1(IO,_DIFFIO_L7n,_(DQ1L)/_) ; port RTC.CLKOUT
DAU_SPI_CLK: U30.E7(IO,_(DATA5),_(DQ3T)/(DQ5T)) ; port DB_SPI.CLK
DAU_SPI_DIN: U30.A3(IO,_DIFFIO_T2n) ; port DB_SPI.DOUT
DAU_SPI_DOUT: U30.E6(IO,_(DATA6),_(DQ3T)/(DQ5T)) ; port DB_SPI.DIN
DAU_SPI_MODE: U30.B10(IO,_DIFFIO_T14p,_(DQ5T)/(DQ5T)) ; port DB_SPI.MODE
DAU_SPI_SEL: U30.D5(IO,_DIFFIO_T3n) ; port DB_SPI.SEL
DB_CLK1: R1_HOST.1 U30.F14(IO,_VREFB6N0)
DIAG_CLK: U30.N2(IO,_DIFFIO_L9p,_(DQ1L)/_) ; port DIAGCOMMS.SCLK
DIAG_CS_N: R99.1 U30.P2(IO,_DIFFIO_L10p,_(DQ1L)/_) ; port DIAGCOMMS.FLASH_CS_N
DIAG_DIN: U30.T4(IO,_PLL1_CLKOUTn) ; port DIAGCOMMS.DIN
DIAG_DOUT: U30.K5(IO,_RUP1,_(DQ1L)/_) ; port DIAGCOMMS.DOUT
EXTSPI_CSA_N0: U30.N5(IO,_DIFFIO_B4p,_(DQ3B)/(DQ5B))
EXTSPI_CSA_N1: U30.M7(IO,_DIFFIO_B5p,_(DQS3B/CQ3B#)/(DQS3B/CQ3B#))
EXTSPI_DIN: U30.L2(IO,_DIFFIO_L8p,_(DQS1L/CQ1L#,DPCLK1)/(DQS1L/CQ1L#,DPCLK1)) ; port EXTSPI.DIN
EXTSPI_DOUT: U30.P1(IO,_DIFFIO_L10n,_(DM1L/BWS#1L)/_) ; port EXTSPI.DOUT
EXTSPI_SCLK: U30.G1(IO,_DIFFIO_L4n) ; port EXTSPI.SCLK
FLASH_BOOT_CLK: U30.L6(IO,_DIFFIO_L6n) ; sheet HOST_NonIO/DCLK, port FLASH_BOOT.SCLK, port FLASH_GOLDEN.SCLK
FLASH_BOOT_CS_N: U30.D2(IO,_DIFFIO_L2p,_(FLASH_nCE,_nCSO)) U69.4(A)
FLASH_BOOT_DATAOUT: R3#2.2 ; port FLASH_BOOT.DOUT, port FLASH_GOLDEN.DOUT
FLASH_BOOT_DIN: U30.C1(IO,_DIFFIO_L1n,_(DATA1,_ASDO)) ; port FLASH_BOOT.DIN, port FLASH_GOLDEN.DIN
FLASH_BOOT_DOUT: R3#2.1 U30.H2(IO,_(DATA0))
FLASH_BOOT_SEL: J24.1 R271.1 U30.K16(IO,_DIFFIO_R8n,_(DQ1R)/_) U69.6(S)
FLASH_GOLD_CS_N: R2#2.1 U30.A5(IO,_(DATA7),_(DQ3T)/(DQ5T)) U69.1(B1) ; port FLASH_GOLDEN.FLASH_CS_N
FLASH_MAIN_CS_N: R1#2.1 U69.3(B0) ; port FLASH_BOOT.FLASH_CS_N
FPGA_CCLK: U30.A2(IO,_DIFFIO_T5n) ; port DB_PROGRAM.CCLK
FPGA_CLK: U30.E2(CLK0,_DIFFCLK_0p) ; port CLK_PLL.CLK_PROG, port DB_CLOCKS.FPGA_CLK
FPGA_DIN: U30.B3(IO,_DIFFIO_T2p,_(DQS1T/CQ1T#,DPCLK7)/(DQS1T/CQ1T#,DPCLK7)) ; port DB_PROGRAM.DIN
FPGA_DONE: U30.A4(IO,_DIFFIO_T4n,_(DM3T/BWS#3T)/(DM5T1/BWS#5T1)) ; port DB_PROGRAM.DONE
FPGA_ID0: U30.P14(IO,_DIFFIO_B21p)
FPGA_ID1: U30.D4(IO)
FPGA_ID2: U30.R11(IO,_DIFFIO_B16p,_(DQ5B)/(DQ5B))
FPGA_ID3: U30.B4(IO,_DIFFIO_T4p)
FPGA_INIT: U30.D6(IO,_DIFFIO_T3p) ; port DB_PROGRAM.INIT
FPGA_M0: U30.K9(IO,_DIFFIO_B13p)
FPGA_PROG_CLK: port DB_PROGRAM.PROG_CLK
FPGA_PROG_PWR_ON: port DB_PROGRAM.PROG_PWR_ON
FPGA_PROGRAM: U30.T9(IO,_DIFFIO_B12n) ; port DB_PROGRAM.PROGRAM
FPGA_TCK: U30.B6(IO,_DIFFIO_T7p,_(DQ3T)/(DQ5T)) ; harness JTAG.TCK
FPGA_TDI: U30.F8(IO,_DIFFIO_T10p,_(DATA3)) ; harness JTAG.TDI
FPGA_TDO: U30.R10(IO,_DIFFIO_B15p,_(DQ5B)/(DQ5B)) ; harness JTAG.TDO
FPGA_TMS: U30.F6(IO,_DIFFIO_T8n) ; harness JTAG.TMS
HOST_HARD_TCK: sheet HOST_NonIO/TCK, harness JTAG.TCK
HOST_HARD_TDI: sheet HOST_NonIO/TDI, harness JTAG.TDI
HOST_HARD_TDO: sheet HOST_NonIO/TDO, harness JTAG.TDO
HOST_HARD_TMS: sheet HOST_NonIO/TMS, harness JTAG.TMS
HOST_SOFT_TCK: U30.E15(CLK4,_DIFFCLK_2p) ; harness JTAG.TCK
HOST_SOFT_TDI: U30.J14(IO,_DIFFIO_R6n,_(DQ1R)/_) ; harness JTAG.TDI
HOST_SOFT_TDO: U30.B11(IO,_DIFFIO_T17p,_(DQ5T)/(DQ5T)) ; harness JTAG.TDO
HOST_SOFT_TMS: U30.G15(IO,_DIFFIO_R4p,_(CRC_ERROR)) ; harness JTAG.TMS
HUSB_D0: U30.F9(IO,_DIFFIO_T16p,_(DQS2T/CQ3T)/(DQS2T/CQ3T))
HUSB_D1: U30.R14(IO)
HUSB_D2: U30.A11(IO,_DIFFIO_T17n,_(DQ5T)/(DQ5T))
HUSB_D3: U30.D11(IO,_DIFFIO_T20n)
HUSB_D4: U30.J16(IO,_DIFFIO_R7n,_(DEV_OE))
HUSB_D5: U30.F11(IO,_DIFFIO_T15n)
HUSB_D6: U30.F10(IO,_DIFFIO_T16n)
HUSB_D7: U30.A9(IO,_DIFFIO_T12n)
HUSB_D8: U30.D8(IO,_(DQ3T)/(DQ5T))
HUSB_D9: U30.A8(IO,_DIFFIO_T11n)
HUSB_D10: U30.A12(IO,_DIFFIO_T18n,_(DQ5T)/(DQ5T))
HUSB_D11: U30.C8(IO,_(DQS5T/CQ5T#)/(DQS5T/CQ5T#))
HUSB_D12: U30.K15(IO,_DIFFIO_R8p,_(DQS1R/CQ1R#,DPCLK4)/(DQS1R/CQ1R#,DPCLK4))
HUSB_D13: U30.A10(IO,_DIFFIO_T14n,_(DQ5T)/(DQ5T))
HUSB_D14: U30.A6(IO,_DIFFIO_T7n,_(DQS3T/CQ3T#)/(DQS3T/CQ3T#))
HUSB_D15: U30.F7(IO,_DIFFIO_T8p)
HUSB_FIFOADR0: U30.E8(IO,_DIFFIO_T10n,_(DATA2),_(DQ3T)/(DQ5T)) ; port HOSTUSB.FIFOADR0
HUSB_FIFOADR1: U30.D16(IO,_DIFFIO_R2n) ; port HOSTUSB.FIFOADR1
HUSB_FIFOADR2: U30.D9(IO,_DIFFIO_T13p,_(DM5T/BWS#5T)/(DM5T0/BWS#5T0)) ; port HOSTUSB.FIFOADR2
HUSB_FLAGA: U30.B12(IO,_DIFFIO_T18p,_(DQ5T)/(DQ5T)) ; port HOSTUSB.FLAGA
HUSB_FLAGB: U30.E11(IO,_RUP4) ; port HOSTUSB.FLAGB
HUSB_FLAGC: U30.E9(IO,_(DQS4T/CQ5T)/(DQS4T/CQ5T)) ; port HOSTUSB.FLAGC
HUSB_FLAGD_CS_N: U30.B7(IO,_DIFFIO_T9p,_(DATA4),_(DQ3T)/(DQ5T)) ; port HOSTUSB.FLAGD_CS_N
HUSB_IFCLK: U30.C11(IO,_VREFB7N0) ; port HOSTUSB.IFCLK
HUSB_INT_N: U30.C9(IO,_DIFFIO_T13n,_(DQ5T)/(DQ5T)) ; port HOSTUSB.INT_N
HUSB_PKTEND: U30.B9(IO,_DIFFIO_T12p) ; port HOSTUSB.PKTEND
HUSB_RD_N: U30.A7(IO,_DIFFIO_T9n,_(DQ3T)/(DQ5T)) ; port HOSTUSB.RD_N
HUSB_READY: U30.J13(IO,_(DQ1R)/_) ; port HOSTUSB.READY
HUSB_RESET_N: U30.C6(IO,_VREFB8N0) ; port HOSTUSB.RESET_N
HUSB_SLOE: U30.B8(IO,_DIFFIO_T11p) ; port HOSTUSB.SLOE
HUSB_VBUS: U30.B13(IO,_DIFFIO_T19p,_(DQ5T)/(DQ5T)) ; port HOSTUSB.VBUS
HUSB_WR_N: U30.L16(IO,_DIFFIO_R9n,_(DQ1R)/_) ; port HOSTUSB.WR_N
LED1_BLUE: U30.R7(IO,_DIFFIO_B8p,_(DQ3B)/(DQ5B)) ; sheet PULLDOWN/INT.BLUE
LED1_GREEN: U30.K8(IO,_DIFFIO_B5n) ; sheet PULLDOWN/INT.GREEN
LED1_RED: U30.F5(IO) ; sheet PULLDOWN/INT.RED
LED2_BLUE: U30.B1(IO,_(DQS2L/CQ3L)/(DQS2L/CQ3L)) ; sheet PULLDOWN/INT.BLUE
LED2_GREEN: U30.R9(IO,_DIFFIO_B12p) ; sheet PULLDOWN/INT.GREEN
LED2_RED: U30.C2(IO,_DIFFIO_L1p) ; sheet PULLDOWN/INT.RED
NEXUS_TCK: U30.T2(IO,_(DQS1B/CQ1B#,DPCLK2)/(DQS1B/CQ1B#,DPCLK2)) ; harness JTAG.TCK
NEXUS_TDI: U30.L9(IO,_DIFFIO_B13n) ; harness JTAG.TDI
NEXUS_TDO: U30.B5(IO,_DIFFIO_T5p,_(DQ3T)/(DQ5T)) ; harness JTAG.TDO
NEXUS_TMS: U30.E5(IO) ; harness JTAG.TMS
ONE_WIRE_ID: U30.L13(IO,_(DQ1R)/_) ; port 1WID.DATA
ONE_WIRE_PB_ID_A: U30.R6(IO,_DIFFIO_B7p,_(DQ3B)/(DQ5B)) ; harness ONE_WIRE.ID
ONE_WIRE_PIOA1: U30.N1(IO,_DIFFIO_L9n,_(DQ1L)/_)
ONE_WIRE_PIOA2: U30.M8(IO,_DIFFIO_B9n,_(DM5B/BWS#5B)/(DM5B0/BWS#5B0))
PB_SPAREA1: U30.T8(IO,_DIFFIO_B11n)
PB_SPAREA2: U30.T6(IO,_DIFFIO_B7n)
PB_SPAREA3: U30.K2(IO,_DIFFIO_L7p)
PB_SPAREA4: U30.L7(IO,_(DQ3B)/(DQ5B))
REF_CLK: U30.M15(CLK6,_DIFFCLK_3p) ; port CLK_PLL.CLK_FIXED, port DB_CLOCKS.REF_CLK
RTC_CS: U30.G5(IO) ; port RTC.CS_N
RTC_DIN: U30.D1(IO,_DIFFIO_L2n) ; port RTC.DIN
RTC_DOUT: U30.K10(IO,_DIFFIO_B18p) ; port RTC.DOUT
RTC_INT_N: U30.M12(IO) ; port RTC.INT_N
RTC_SCLK: U30.M6(IO,_(DQ3B)/(DQ5B)) ; port RTC.SCLK
SD_CLK: U30.N12(IO,_DIFFIO_B22n) ; port SD.CLK
SD_CMD: U30.R3(IO,_DIFFIO_B2p,_(DQ3B)/(DQ5B)) ; port SD.CMD
SD_DAT0: U30.P3(IO,_DIFFIO_B1n,_(DM3B/BWS#3B)/(DM5B1/BWS#5B1))
SD_DAT1: U30.R5(IO,_DIFFIO_B6p,_(DQ3B)/(DQ5B))
SD_DAT2: U30.T5(IO,_DIFFIO_B6n)
SD_DAT3: U30.T3(IO,_DIFFIO_B2n)
SD_DETECT: U30.N8(IO,_DIFFIO_B10p,_(DQ5B)/(DQ5B)) ; port SD.DETECT
SD_PROTECT: U30.R4(IO,_PLL1_CLKOUTp) ; port SD.PROTECT
SRAM_A0: U30.D12(IO,_DIFFIO_T20p,_(DQS0T/CQ1T,DPCLK6)/(DQS0T/CQ1T,DPCLK6))
SRAM_A1: U30.B14(IO,_PLL2_CLKOUTp)
SRAM_A2: U30.A14(IO,_PLL2_CLKOUTn)
SRAM_A3: U30.H16(IO,_DIFFIO_R5n)
SRAM_A4: U30.E10(IO,_RDN4)
SRAM_A5: U30.T12(IO,_DIFFIO_B17n,_(DQ5B)/(DQ5B))
SRAM_A6: U30.N13(IO)
SRAM_A7: U30.M11(IO,_DIFFIO_B22p)
SRAM_A8: U30.N14(IO,_RUP3,_(DM1R/BWS#1R)/_)
SRAM_A9: U30.N11(IO,_RDN2)
SRAM_A10: U30.K12(IO)
SRAM_A11: U30.L12(IO)
SRAM_A12: U30.J11(IO)
SRAM_A13: U30.N16(IO,_DIFFIO_R10n,_(DQ1R)/_)
SRAM_A14: U30.J12(IO,_DIFFIO_R6p)
SRAM_A15: U30.R16(IO,_DIFFIO_R11p,_(DQ1R)/_)
SRAM_A16: U30.H15(IO,_DIFFIO_R5p)
SRAM_A17: U30.N15(IO,_DIFFIO_R10p,_(DQ1R)/_)
SRAM_A18: U30.J15(IO,_DIFFIO_R7p,_(DEV_CLRn))
SRAM_D0: U30.A15(IO,_DIFFIO_T15p)
SRAM_D1: U30.L11(IO,_DIFFIO_B21n)
SRAM_D2: U30.T15(IO,_DIFFIO_B20n,_(DQS0B/CQ1B,DPCLK3)/(DQS0B/CQ1B,DPCLK3))
SRAM_D3: U30.R12(IO,_DIFFIO_B17p,_(DQ5B)/(DQ5B))
SRAM_D4: U30.A13(IO,_DIFFIO_T19n)
SRAM_D5: U30.R13(IO,_DIFFIO_B19p)
SRAM_D6: U30.C14(IO,_DIFFIO_T21n)
SRAM_D7: U30.T14(IO,_DIFFIO_B20p,_(DQ5B)/(DQ5B))
SRAM_D8: U30.F16(IO,_DIFFIO_R3n,_(nCEO))
SRAM_D9: U30.L14(IO,_VREFB5N0)
SRAM_D10: U30.G11(IO)
SRAM_D11: U30.D15(IO,_DIFFIO_R2p)
SRAM_D12: U30.K11(IO)
SRAM_D13: U30.T13(IO,_DIFFIO_B19n,_(DQ5B)/(DQ5B))
SRAM_D14: U30.C15(IO,_DIFFIO_R1p)
SRAM_D15: U30.G16(IO,_DIFFIO_R4n,_(INIT_DONE))
SRAM_NBHE: U30.D14(IO,_DIFFIO_T21p,_(DQ5T)/(DQ5T)) ; port SRAM.NBHE
SRAM_NBLE: U30.P15(IO,_RDN3,_(DQ1R)/_) ; port SRAM.NBLE
SRAM_NCS: U30.F13(IO) ; port SRAM.NCS
SRAM_NOE: U30.B16(IO,_(DQS0R/CQ1R,DPCLK5)/(DQS0R/CQ1R,DPCLK5)) ; port SRAM.NOE
SRAM_NWE: U30.C16(IO,_DIFFIO_R1n,_(DQS2R/CQ3R)/(DQS2R/CQ3R)) ; port SRAM.NWE
USB_XTALIN: port HOSTUSB.XTALIN
USB_XTALOUT: port HOSTUSB.XTALOUT
USERFLASH1_CS_N: U30.P6(IO,_VREFB3N0) ; port FLASH_USER.FLASH1_CS_N
USERFLASH2_CS_N: U30.T7(IO,_DIFFIO_B8n,_(DQS5B/CQ5B#)/(DQS5B/CQ5B#)) ; port FLASH_USER.FLASH2_CS_N
USERFLASH_DIN: U30.N6(IO,_DIFFIO_B4n,_(DQ3B)/(DQ5B)) ; port FLASH_USER.DIN
USERFLASH_DOUT: U30.N3(IO,_DIFFIO_B1p) ; port FLASH_USER.DOUT
USERFLASH_SCLK: U30.J6(IO) ; port FLASH_USER.SCLK
NetJ24_2: J24.2 R269.1
NetR1_HOST_2: R1_HOST.2 ; port DB_CLOCKS.FPGA_CLK1

Not connected (* = marked no-connect by the designer): R270 1*; U30 E1(CLK1,_DIFFCLK_0n)* E16(CLK5,_DIFFCLK_2n)* L8(IO,_DIFFIO_B9p,_(DQ3B)/(DQ5B))* L10(IO,_DIFFIO_B18n)* L15(IO,_DIFFIO_R9p)* M1(CLK3,_DIFFCLK_1n)* M2(CLK2,_DIFFCLK_1p)* M10(IO,_RUP2)* M16(CLK7,_DIFFCLK_3n)* N9(IO,_DIFFIO_B14n,_(DQ5B)/(DQ5B))* P8(IO,_DIFFIO_B10n,_(DQ5B)/(DQ5B))* T10(IO,_DIFFIO_B15n,_(DQS4B/CQ5B)/(DQS4B/CQ5B))* T11(IO,_DIFFIO_B16n)*

### Buses and harness runs
bus CLK_EXTA[2..0]
bus EXTSPI_CSA_N[1..0]
bus FPGA_ID[3..0]
bus FPGA_M[2..0]
bus HUSB_D[15..0]
bus ONE_WIRE_PIOA[1..2]
bus PB_SPAREA[1..4]
bus SD_DAT[3..0]
bus SRAM_A[18..0]
bus SRAM_D[15..0]
harness port LED1 = sheet PULLDOWN/EXT
harness port LED2 = sheet PULLDOWN/EXT

### Notes on the sheet
- SYSTEM CLOCKS
- HOST RTC
- USER FPGA JTAG
- HOST USB
- PB - Control
- SRAM - 64K/256K x 16
- USB2
- ONE WIRE ID
- USER FPGA PROGRAM
- USER 8MB SPI FLASH x2
- HOST AUDIO - Delta-Sigma
- PB SPI
- SYSBOOT
- HOST JTAG
- Altera SCD
- USER FPGA SPI
- HOST SD CARD
- Host LEDs
- GOLDEN
- (near J24) PLATFORM UPGRADE
- PLATFORM UPGRADE
- NO JUMPER INSTALLED - BOOT FROM MAIN FLASH
- JUMPER PINS 1 AND 2 - BOOT FROM GOLD FLASH
- 1V2
- 3V3
- PLL1
- PLL2
- Project Title
- Sheet Title
- Size:
- Date:
- File:
- A2
- Assy:
- Time:
- Revision:
- Sheet
- of
- (in symbol EP3C10F256C8, part A) BANK 1
- (in symbol EP3C10F256C8, part B) BANK 2
- (in symbol EP3C10F256C8, part C) BANK 3
- (in symbol EP3C10F256C8, part D) BANK 4
- (in symbol EP3C10F256C8, part E) BANK 5
- (in symbol EP3C10F256C8, part F) BANK 6
- (in symbol EP3C10F256C8, part G) BANK 7
- (in symbol EP3C10F256C8, part H) BANK 8

### Library data of the parts
J24 = D-300-0020: Header IDC, 2 x 1 Pin Vertical 2.54mm Pitch (Non-Boxed, Male); Max Current: 3 A; Category: Connector; Connector type: Header; Mounting Technology: Through-Hole; Pin Count: 2; Status: Production
R1#2 R2#2 R99 = D-100-0088: as R284-R286 on sheet PULLDNx3; Category: Resistor; Mounting Technology: Surface Mount; Status: Production; Tolerance: 1 %
R1_HOST = D-100-0085: Resistor, 5R6 1% 0402 (1005); Power Rating: 63 mW; Resistance: 5.6 R; Category: Resistor; Status: Production; Mounting Technology: Surface Mount; Tolerance: 1 %
R3#2 = D-100-0130: Resistor, 10K 1% 0402 (1005); Power Rating: 63 mW; Category: Resistor; Mounting Technology: Surface Mount; Resistance: 10 K; Status: Production; Tolerance: 1 %
R269 = D-100-0121: UPDATE FROM UL LIBRARIES; Power Rating: 63 mW; Resistance: 1 K; Category: Resistor; Mounting Technology: Surface Mount; Status: Production; Tolerance: 1 %
R270 = D-100-0107: Resistor, 2K2 1% 0402 (1005); Power Rating: 63 mW; Resistance: 2.2 K; Category: Resistor; Mounting Technology: Surface Mount; Status: Production; Tolerance: 1 %
R271 = D-100-0130: UPDATE FROM UL LIBRARIES; Power Rating: 63 mW; Resistance: 10 K; Category: Resistor; Mounting Technology: Surface Mount; Status: Production; Tolerance: 1 %
U30 = EP3C10F256C8: Cyclone III Family FPGA, 182 I/O Pins, 4 PLLs, 256-Pin FBGA, Speed Grade 8, Commercial Grade; Published: 26-Feb-2007; DatasheetVersion: ver2.0, May-2008; PackageVersion: ver15.1, May-2008; PackageReference: FBGA256-2; Publisher: Altium Limited; PackageDescription: 256-Ball FineLine Ball Grid Array (FBGA256) - Option 2 - Wire Bond; Code_JEDEC: MO-192-DAF-1; ComponentLink1Description: Manufacturer Link; ComponentLink1URL: http://www.altera.com/; ComponentLink2Description: Handbook (7.86MB); ComponentLink2URL: http://www.altera.com/literature/hb/cyc3/cyclone3_handbook.pdf; ComponentLink3Description: Packaging Specification; ComponentLink3URL: http://www.altera.com/literature/ds/dspkg.pdf
U69 = D-200-0006: Low Voltage 1R  SPDT Analog Switc; Supply Voltage: mV; Mounting Technology: Surface Mount; Status: Unreleased; Category: IC-Analog

## Sheet HOST_FPGA_NonIO.SchDoc: Host FPGA Pwr and Programming
size A4; Organization: Altium Limited.
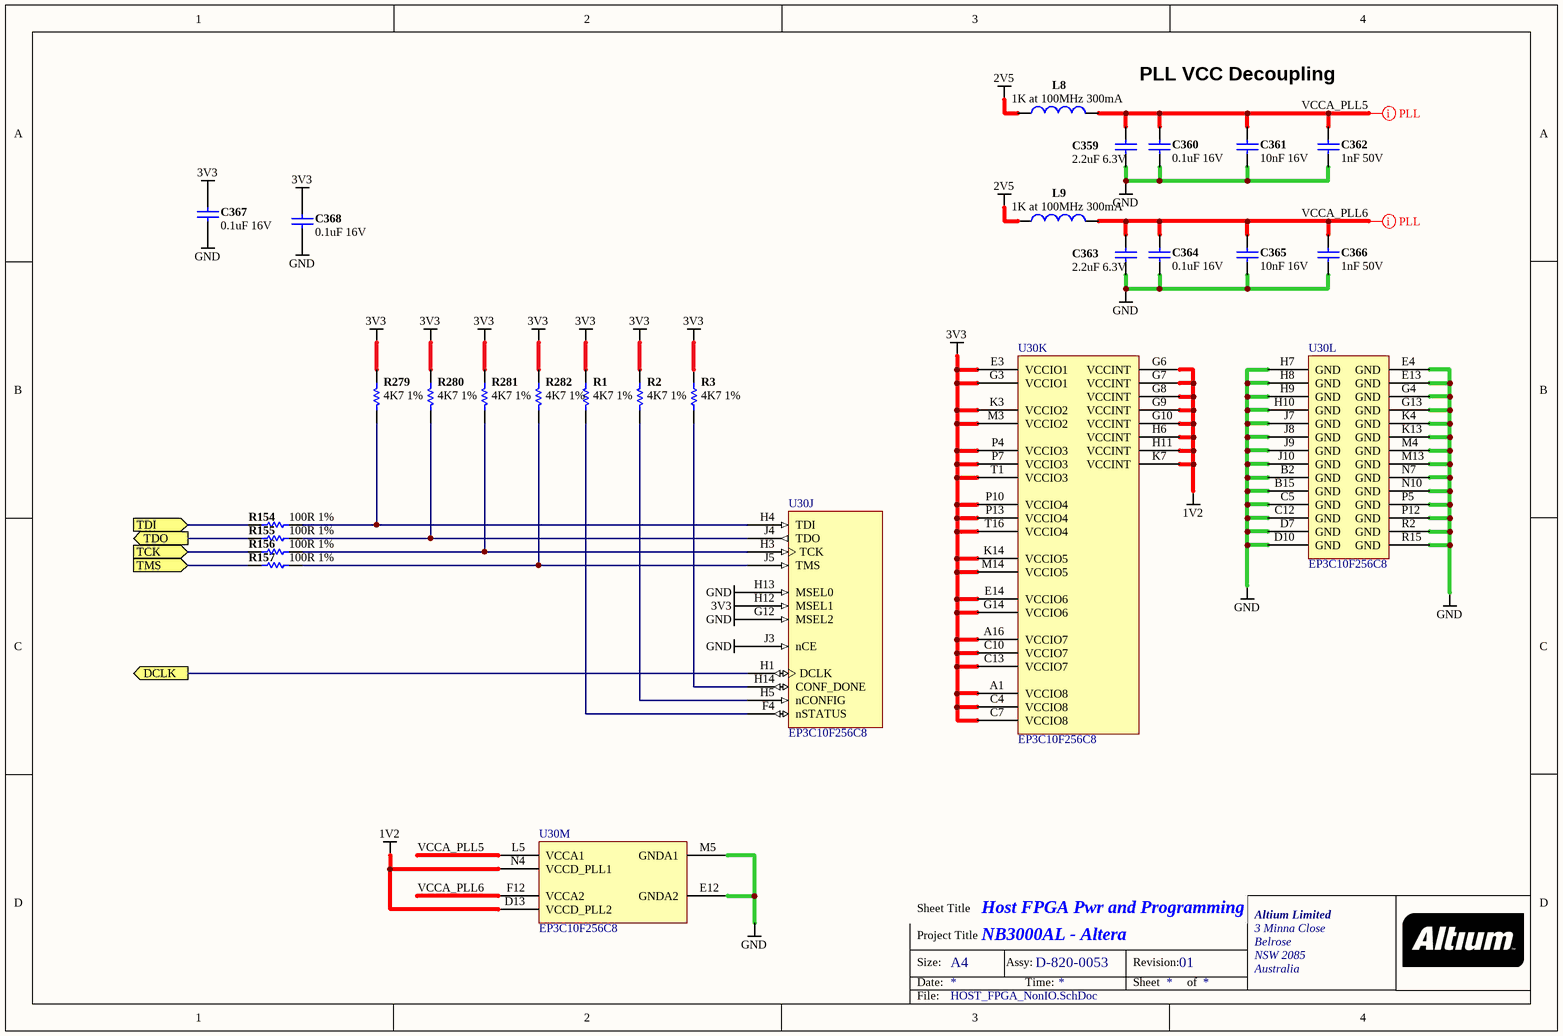
[diagram p19: HOST_FPGA_NonIO.SchDoc]

### Parts
(Parts that share a designator on the sheet are numbered #1, #2 ... from top to bottom, then left to right.)
C359  2.2uF 6.3V  [CAPC1005-STAR]
C360  0.1uF 16V  [CAPC1005-STAR]
C361  10nF 16V  [CAPC1005-STAR]
C362  1nF 50V  [CAPC1005-STAR]
C363  2.2uF 6.3V  [CAPC1005-STAR]
C364  0.1uF 16V  [CAPC1005-STAR]
C365  10nF 16V  [CAPC1005-STAR]
C366  1nF 50V  [CAPC1005-STAR]
C367  0.1uF 16V  [CAPC1005-STAR]
C368  0.1uF 16V  [CAPC1005-STAR]
L8  1K at 100MHz 300mA  [INDC1005]
L9  1K at 100MHz 300mA  [INDC1005]
R1#3  4K7 1%  [RESC1005-STAR]
R2#3  4K7 1%  [RESC1005-STAR]
R3#3  4K7 1%  [RESC1005-STAR]
R154#2  100R 1%  [RESC1005-STAR]
R155  100R 1%  [RESC1005-STAR]
R156  100R 1%  [RESC1005-STAR]
R157  100R 1%  [RESC1005-STAR]
R279  4K7 1%  [RESC1005-STAR]
R280  4K7 1%  [RESC1005-STAR]
R281  4K7 1%  [RESC1005-STAR]
R282  4K7 1%  [RESC1005-STAR]
U30  EP3C10F256C8  [FBGA256-2]  (parts J,K,L,M of 13)

### Ports
DCLK (out), TCK (in), TDI (in), TDO (out), TMS (in)

### Nets
1V2: U30.D13(VCCD_PLL2) U30.G6(VCCINT) U30.G7(VCCINT) U30.G8(VCCINT) U30.G9(VCCINT) U30.G10(VCCINT) U30.H6(VCCINT) U30.H11(VCCINT) U30.K7(VCCINT) U30.N4(VCCD_PLL1)
2V5: L8.1 L9.1
3V3: C367.1 C368.1 R1#3.1 R2#3.1 R3#3.1 R279.1 R280.1 R281.1 R282.1 U30.A1(VCCIO8) U30.A16(VCCIO7) U30.C4(VCCIO8) U30.C7(VCCIO8) U30.C10(VCCIO7) U30.C13(VCCIO7) U30.E3(VCCIO1) U30.E14(VCCIO6) U30.G3(VCCIO1) U30.G14(VCCIO6) U30.H12(MSEL1) U30.K3(VCCIO2) U30.K14(VCCIO5) U30.M3(VCCIO2) U30.M14(VCCIO5) U30.P4(VCCIO3) U30.P7(VCCIO3) U30.P10(VCCIO4) U30.P13(VCCIO4) U30.T1(VCCIO3) U30.T16(VCCIO4)
GND: C359.2 C360.2 C361.2 C362.2 C363.2 C364.2 C365.2 C366.2 C367.2 C368.2 U30.B2(GND) U30.B15(GND) U30.C5(GND) U30.C12(GND) U30.D7(GND) U30.D10(GND) U30.E4(GND) U30.E12(GNDA2) U30.E13(GND) U30.G4(GND) U30.G12(MSEL2) U30.G13(GND) U30.H7(GND) U30.H8(GND) U30.H9(GND) U30.H10(GND) U30.H13(MSEL0) U30.J3(nCE) U30.J7(GND) U30.J8(GND) U30.J9(GND) U30.J10(GND) U30.K4(GND) U30.K13(GND) U30.M4(GND) U30.M5(GNDA1) U30.M13(GND) U30.N7(GND) U30.N10(GND) U30.P5(GND) U30.P12(GND) U30.R2(GND) U30.R15(GND)
FLASH_BOOT_CLK: U30.H1(DCLK) ; port DCLK
HOST_HARD_TCK: R156.1 ; port TCK
HOST_HARD_TDI: R154#2.1 ; port TDI
HOST_HARD_TDO: R155.1 ; port TDO
HOST_HARD_TMS: R157.1 ; port TMS
VCCA_PLL5: C359.1 C360.1 C361.1 C362.1 L8.2 U30.L5(VCCA1)
VCCA_PLL6: C363.1 C364.1 C365.1 C366.1 L9.2 U30.F12(VCCA2)
NetR1#3_2: R1#3.2 U30.F4(nSTATUS)
NetR2#3_2: R2#3.2 U30.H5(nCONFIG)
NetR3#3_2: R3#3.2 U30.H14(CONF_DONE)
NetR154#2_2: R154#2.2 R279.2 U30.H4(TDI)
NetR155_2: R155.2 R280.2 U30.J4(TDO)
NetR156_2: R156.2 R281.2 U30.H3(TCK)
NetR157_2: R157.2 R282.2 U30.J5(TMS)

### Layout directives
net class PLL: VCCA_PLL5, VCCA_PLL6

### Notes on the sheet
- PLL VCC Decoupling
- Sheet Title
- Project Title
- Size:
- Date:
- A4
- Assy:
- Time:
- Revision:
- Sheet
- of
- File:

### Library data of the parts
C359 C363 = D-101-0112: as C343#1 on sheet FPGA_NonIO; Capacitance: 2.2 uF; Dielectric: X5R; Mounting Technology: Surface Mount; Rated Voltage: 6.3 V; Status: Unreleased; Technology: None; Category: Capacitor
C360 C364 C367 C368 = D-101-0080: as C344#1 on sheet FPGA_NonIO; Capacitance: 0.1 uF; Dielectric: X7R; Mounting Technology: Surface Mount; Rated Voltage: 16 V; Status: Production; Technology: Ceramic; Tolerance: 10 %; Category: Capacitor
C361 C365 = D-101-0077: as C345#1 on sheet FPGA_NonIO; Capacitance: 10 nF; Dielectric: X7R; Mounting Technology: Surface Mount; Rated Voltage: 16 V; Status: Production; Technology: Ceramic; Tolerance: 10 %; Category: Capacitor
C362 C366 = D-101-0030: as C346 on sheet FPGA_NonIO; Capacitance: 1 nF; Dielectric: X7R; Mounting Technology: Surface Mount; Rated Voltage: 50 V; Status: Production; Technology: Ceramic; Tolerance: 10 %; Category: Capacitor
L8 L9 = D-102-0026: as L4 on sheet FPGA_NonIO; Max Input Current: 300 mA; Mounting Technology: Surface Mount; Status: Production; Category: Inductor
R1#3 R2#3 R3#3 R279-R282 = D-100-0088: as R284-R286 on sheet PULLDNx3; Category: Resistor; Mounting Technology: Surface Mount; Status: Production; Tolerance: 1 %
R154#2 R155-R157 = D-100-0131: Resistor, 100R 1% 0402 (1005); Power Rating: 63 mW; Mounting Technology: Surface Mount; Resistance: 100 R; Status: Production; Tolerance: 1 %; Category: Resistor
U30 = EP3C10F256C8: as U30 on sheet Host_FPGA; Published: 26-Feb-2007; DatasheetVersion: ver2.0, May-2008; PackageVersion: ver15.1, May-2008; PackageReference: FBGA256-2; Publisher: Altium Limited; PackageDescription: 256-Ball FineLine Ball Grid Array (FBGA256) - Option 2 - Wire Bond; Code_JEDEC: MO-192-DAF-1; ComponentLink1Description: Manufacturer Link; ComponentLink1URL: http://www.altera.com/; ComponentLink2Description: Handbook (7.86MB); ComponentLink2URL: http://www.altera.com/literature/hb/cyc3/cyclone3_handbook.pdf; ComponentLink3Description: Packaging Specification; ComponentLink3URL: http://www.altera.com/literature/ds/dspkg.pdf

## Sheet USB_CY7C68001-56LFC.SchDoc: High-Speed USB 2.0 Controller
size A4; Organization: Altium Limited.; Address1: Level 3, 12a Rodborough Rd; Address2: Frenchs Forest 2086; Address3: NSW; Address4: AUSTRALIA; DocumentNumber: 49; SheetNumber: 50; SheetTotal: 78
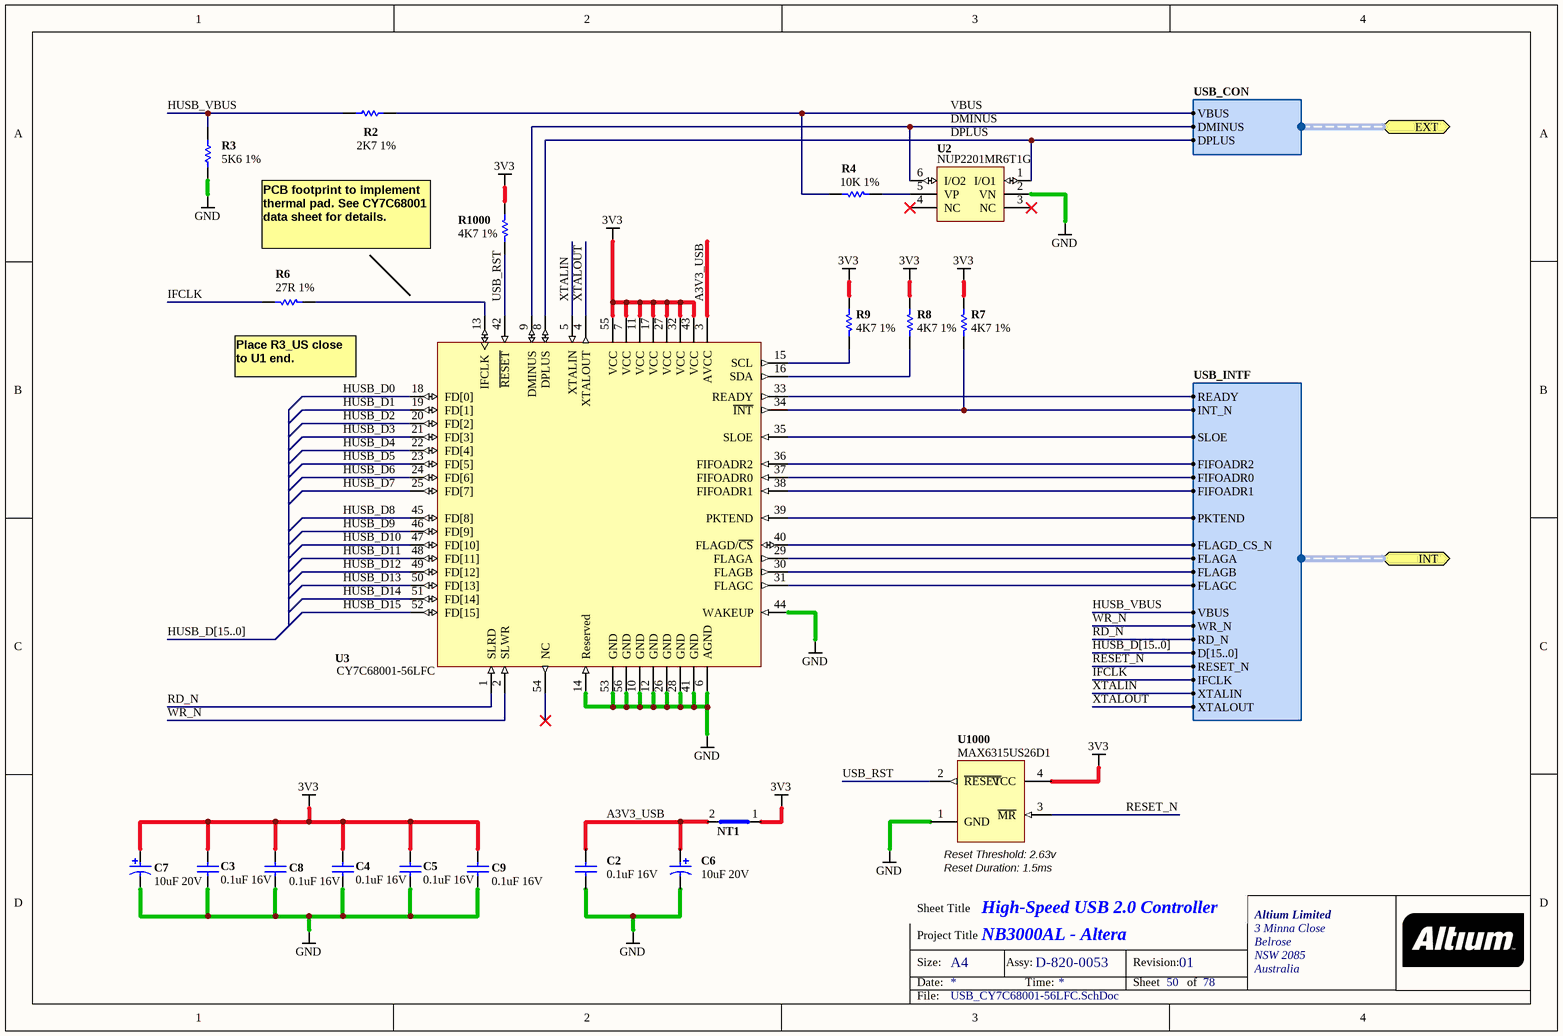
[diagram p20: USB_CY7C68001-56LFC.SchDoc]

### Parts
(Parts that share a designator on the sheet are numbered #1, #2 ... from top to bottom, then left to right.)
C2#2  0.1uF 16V  [CAPC1005-STAR]
C3#2  0.1uF 16V  [CAPC1005-STAR]
C4#2  0.1uF 16V  [CAPC1005-STAR]
C5#1  0.1uF 16V  [CAPC1005-STAR]
C6#1  10uF 20V  [CAPC3528-STAR]
C7#1  10uF 20V  [CAPC3528-STAR]
C8#1  0.1uF 16V  [CAPC1005-STAR]
C9#1  0.1uF 16V  [CAPC1005-STAR]
NT1#3  Net Tie SMT2  [NETTIE-SMT2-31X51]  (value not drawn)  (net tie, no BOM)
R2#4  2K7 1%  [RESC1005-STAR]
R3#4  5K6 1%  [RESC1005-STAR]
R4#2  10K 1%  [RESC1005-STAR]
R6#1  27R 1%  [RESC1005-STAR]
R7#1  4K7 1%  [RESC1005-STAR]
R8#2  4K7 1%  [RESC1005-STAR]
R9#2  4K7 1%  [RESC1005-STAR]
R1000  4K7 1%  [RESC1005-STAR]
U2  NUP2201MR6T1G  [TSOP95P275-6]
U3  CY7C68001-56LFC  [QFN50P800X800_HS-57]
U1000  MAX6315US26D1  [SOT143]

### Ports
EXT (harness USB_CON), INT (harness USB_INTF)

### Harnesses
USB_INTF: READY, INT_N, SLOE, FIFOADR2, FIFOADR0, FIFOADR1, PKTEND, FLAGD_CS_N, FLAGA, FLAGB, FLAGC, WR_N, RD_N, D[15..0], RESET_N, IFCLK, XTALIN, VBUS, XTALOUT
USB_CON: VBUS, DMINUS, DPLUS

### Nets
3V3: C3#2.2 C4#2.2 C5#1.2 C7#1.1 C8#1.1 C9#1.1 NT1#3.1(Net1) R7#1.2 R8#2.1 R9#2.1 R1000.2 U3.7(VCC) U3.11(VCC) U3.17(VCC) U3.27(VCC) U3.32(VCC) U3.43(VCC) U3.55(VCC) U1000.4(VCC)
GND: C2#2.1 C3#2.1 C4#2.1 C5#1.1 C6#1.2 C7#1.2 C8#1.2 C9#1.2 R3#4.2 U2.2(VN) U3.6(AGND) U3.10(GND) U3.12(GND) U3.14(Reserved) U3.26(GND) U3.28(GND) U3.41(GND) U3.44(WAKEUP) U3.53(GND) U3.56(GND) U1000.1(GND)
A3V3_USB: C2#2.2 C6#1.1 NT1#3.2(Net2) U3.3(AVCC)
DMINUS: U2.6(I/O2) U3.9(DMINUS) ; port EXT.DMINUS
DPLUS: U2.1(I/O1) U3.8(DPLUS) ; port EXT.DPLUS
HUSB_D0: U3.18(FD[0])
HUSB_D1: U3.19(FD[1])
HUSB_D2: U3.20(FD[2])
HUSB_D3: U3.21(FD[3])
HUSB_D4: U3.22(FD[4])
HUSB_D5: U3.23(FD[5])
HUSB_D6: U3.24(FD[6])
HUSB_D7: U3.25(FD[7])
HUSB_D8: U3.45(FD[8])
HUSB_D9: U3.46(FD[9])
HUSB_D10: U3.47(FD[10])
HUSB_D11: U3.48(FD[11])
HUSB_D12: U3.49(FD[12])
HUSB_D13: U3.50(FD[13])
HUSB_D14: U3.51(FD[14])
HUSB_D15: U3.52(FD[15])
HUSB_VBUS: R2#4.1 R3#4.1 ; port INT.VBUS
IFCLK: R6#1.1 ; port INT.IFCLK
RD_N: U3.1(SLRD) ; port INT.RD_N
RESET_N: U1000.3(~{MR}) ; port INT.RESET_N
USB_RST: R1000.1 U3.42(~{RESET}) U1000.2(~{RESET})
VBUS: R2#4.2 R4#2.1 ; port EXT.VBUS
WR_N: U3.2(SLWR) ; port INT.WR_N
XTALIN: U3.5(XTALIN) ; port INT.XTALIN
XTALOUT: U3.4(XTALOUT) ; port INT.XTALOUT
NetR4#2_2: R4#2.2 U2.5(VP)
NetR6#1_2: R6#1.2 U3.13(IFCLK)
NetR7#1_1: R7#1.1 U3.34(~{INT}) ; port INT.INT_N
NetR8#2_2: R8#2.2 U3.16(SDA)
NetR9#2_2: R9#2.2 U3.15(SCL)
NetU3_29: U3.29(FLAGA) ; port INT.FLAGA
NetU3_30: U3.30(FLAGB) ; port INT.FLAGB
NetU3_31: U3.31(FLAGC) ; port INT.FLAGC
NetU3_33: U3.33(READY) ; port INT.READY
NetU3_35: U3.35(SLOE) ; port INT.SLOE
NetU3_36: U3.36(FIFOADR2) ; port INT.FIFOADR2
NetU3_37: U3.37(FIFOADR0) ; port INT.FIFOADR0
NetU3_38: U3.38(FIFOADR1) ; port INT.FIFOADR1
NetU3_39: U3.39(PKTEND) ; port INT.PKTEND
NetU3_40: U3.40(FLAGD/~{CS}) ; port INT.FLAGD_CS_N

Not connected (* = marked no-connect by the designer): U2 3(NC)* 4(NC)*; U3 54(NC)*

### Buses and harness runs
bus HUSB_D[15..0]

### Notes on the sheet
- PCB footprint to implement thermal pad. See CY7C68001 data sheet for details.
- (near R6#1) Place R3_US close to U1 end.
- (near U1000) Reset Threshold: 2.63v
- (near U1000) Reset Duration: 1.5ms
- Sheet Title
- Project Title
- Size:
- Date:
- A4
- Assy:
- Time:
- Revision:
- Sheet
- of
- File:

### Library data of the parts
C2#2 C3#2 C4#2 C5#1 C8#1 C9#1 = D-101-0080: as C344#1 on sheet FPGA_NonIO; Category: Capacitor; Capacitance: 0.1 uF; Dielectric: X7R; Mounting Technology: Surface Mount; Rated Voltage: 16 V; Status: Production; Technology: Ceramic; Tolerance: 10 %
C6#1 C7#1 = D-101-0007: Capacitor, Tantalum, 10uF 10% 20V MCCT-B (3528); Polarity: Polarized; Category: Capacitor; Capacitance: 10 uF; Mounting Technology: Surface Mount; Rated Voltage: 20 V; Status: Production; Technology: Tantalum; Tolerance: 10 %
NT1#3 = D-002-0003: Net-Tie, Surface Mount, 2 x 1.6mm x 0.8mm SMT Pads - For 0.8mm Track; Category: Net-Tie; Status: Production
R2#4 = D-100-0105: Resistor, 2K7 1% 0402 (1005); Power Rating: 63 mW; Resistance: 2.7 K; Category: Resistor; Mounting Technology: Surface Mount; Status: Production; Tolerance: 1 %
R3#4 = D-100-0086: Resistor, 5K6 1% 0402 (1005); Power Rating: 63 mW; Resistance: 5.6 K; Category: Resistor; Mounting Technology: Surface Mount; Status: Production; Tolerance: 1 %
R4#2 = D-100-0130: as R3#2 on sheet Host_FPGA; Category: Resistor; Mounting Technology: Surface Mount; Resistance: 10 K; Status: Production; Tolerance: 1 %
R6#1 = D-100-0108: Resistor, 27R 1% 0402 (1005); Power Rating: 63 mW; Category: Resistor; Mounting Technology: Surface Mount; Resistance: 27 R; Status: Production; Tolerance: 1 %
R7#1 R8#2 R9#2 R1000 = D-100-0088: as R284-R286 on sheet PULLDNx3; Category: Resistor; Mounting Technology: Surface Mount; Status: Production; Tolerance: 1 %
U2 = D-204-0001: NUP2201MR6, Low Capacitance Diode Array, USB Protection; Max Input Voltage: mV; Max Output Current: mA; Category: IC-Power; Max Output Voltage: mV; Min Input Voltage: mV; Min Output Voltage: mV; Mounting Technology: Surface Mount; Status: Production; Supply Voltage: mV
U3 = D-221-0004: CY7C68001-56LFC, EZ-USB SX2 High-Speed USB Interface; Comm Standard: None; Category: IC-Communication; Mounting Technology: Surface Mount; Status: Production
U1000 = D-243-0000: MAX6315, Open-Drain Output SOT Reset IC, Customized Reset Thresholds, Timeout Delays; Category: IC-Other; Status: Production

## Sheet OSC_24MHZ.SchDoc: 24MHz Oscillator
size A4; Organization: Altium Limited.
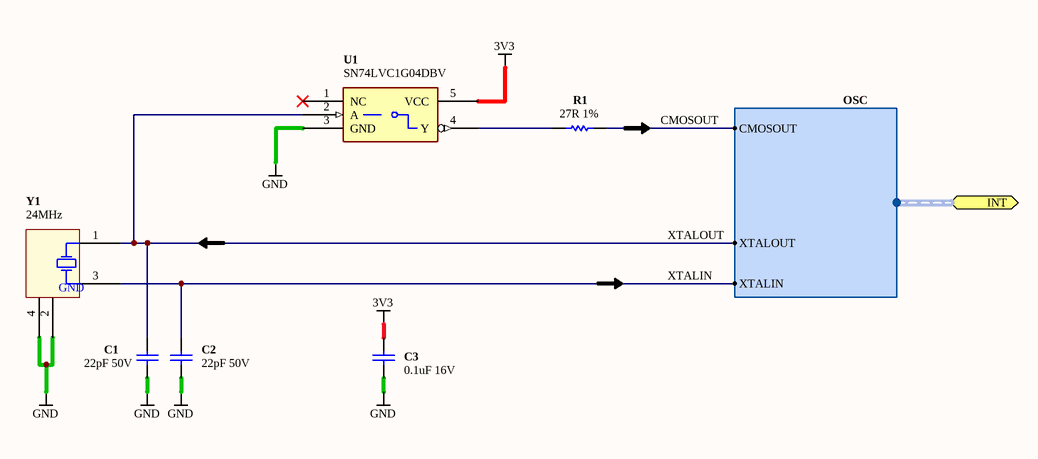
[diagram p21: OSC_24MHZ.SchDoc]

### Parts
(Parts that share a designator on the sheet are numbered #1, #2 ... from top to bottom, then left to right.)
C1#2  22pF 50V  [CAPC1005-STAR]
C2#3  22pF 50V  [CAPC1005-STAR]
C3#3  0.1uF 16V  [CAPC1005-STAR]
R1#4  27R 1%  [RESC1005-STAR]
U1#2  SN74LVC1G04DBV  [SOT95P280-5]
Y1#1  24MHz  [XTAL-200X126-4]

### Ports
INT (harness OSC)

### Harnesses
OSC: CMOSOUT, XTALIN, XTALOUT

### Nets
3V3: C3#3.1 U1#2.5(VCC)
GND: C1#2.2 C2#3.2 C3#3.2 U1#2.3(GND) Y1#1.2(GND) Y1#1.4(GND)
CMOSOUT: R1#4.1 ; port INT.CMOSOUT
XTALIN: C2#3.1 Y1#1.3(X2) ; port INT.XTALIN
XTALOUT: C1#2.1 U1#2.2(A) Y1#1.1(X1) ; port INT.XTALOUT
NetR1#4_2: R1#4.2 U1#2.4(Y)

Not connected (* = marked no-connect by the designer): U1#2 1(NC)*

### Notes on the sheet
- Sheet Title
- Project Title
- Size:
- Date:
- A4
- Assy:
- Time:
- Revision:
- Sheet
- of
- File:

### Library data of the parts
C1#2 C2#3 = D-101-0059: Capacitor, Ceramic, 22pF 5% 50V 0402 (1005) COG; Polarity: Non-Polarized; Category: Capacitor; Capacitance: 22 pF; Dielectric: COG; Mounting Technology: Surface Mount; Rated Voltage: 50 V; Status: Unreleased; Technology: Ceramic; Tolerance: 5 %
C3#3 = D-101-0080: as C344#1 on sheet FPGA_NonIO; Category: Capacitor; Capacitance: 0.1 uF; Dielectric: X7R; Mounting Technology: Surface Mount; Rated Voltage: 16 V; Status: Production; Technology: Ceramic; Tolerance: 10 %
R1#4 = D-100-0108: as R6#1 on sheet USB_CY7C68001-56LFC; Category: Resistor; Mounting Technology: Surface Mount; Resistance: 27 R; Status: Production; Tolerance: 1 %
U1#2 = D-205-0001: SN74LVC1G04DBV, Single Inverter Gate, 1.65-V to 5.5-V; Mounting Technology: Surface Mount; Status: Production; Category: IC-Logic
Y1#1 = D-103-0013: Crystal, SMD, 24.000000MHz Stab=30ppm 20.0pF; Frequency Stability: 30 ppm; Load Capacitance: 20 pF; Nominal Operational Voltage: mV; Category: Crystal; Frequency Tolerance: 30 ppm; Mounting Technology: Surface Mount; Nominal Fequency: 24 MHz; Status: Unreleased

## Sheet CON_AUDIO_AC99_NOMIC.SchDoc: AUDIO AC99 Interface
size A4; Organization: Altium Limited.; Address1: Level 3, 12a Rodborough Rd; Address2: Frenchs Forest 2086; Address3: NSW; Address4: AUSTRALIA; DocumentNumber: 59; SheetNumber: 60; SheetTotal: 78
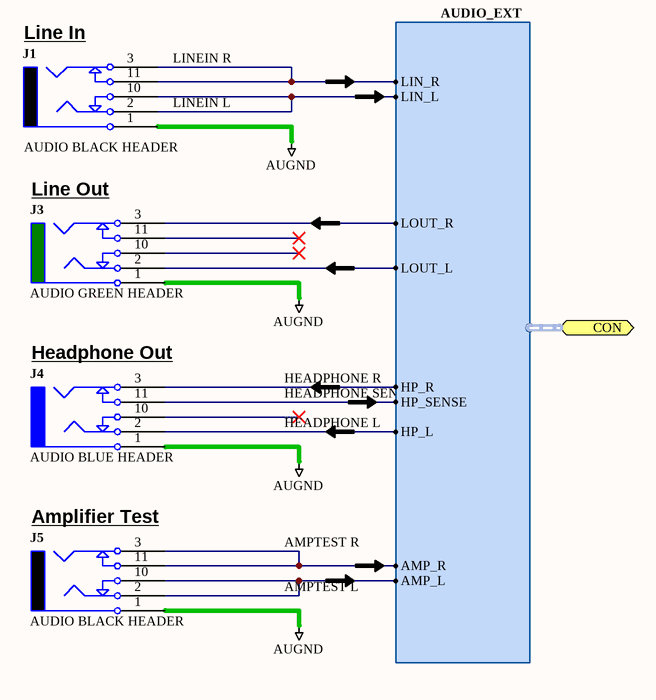
[diagram p22: CON_AUDIO_AC99_NOMIC.SchDoc]

### Parts
(Parts that share a designator on the sheet are numbered #1, #2 ... from top to bottom, then left to right.)
J1#4  AUDIO BLACK HEADER  [TSH-3675]
J3#2  AUDIO GREEN HEADER  [TSH-3675]
J4  AUDIO BLUE HEADER  [TSH-3675]
J5  AUDIO BLACK HEADER  [TSH-3675]

### Ports
CON (harness AUDIO_EXT)

### Harnesses
AUDIO_EXT: AMP_L, AMP_R, HP_L, HP_R, HP_SENSE, LIN_L, LIN_R, LOUT_L, LOUT_R

### Nets
AUGND: J1#4.1 J3#2.1 J4.1 J5.1
NetJ1#4_2: J1#4.2 J1#4.10 ; port CON.LIN_L
NetJ1#4_3: J1#4.3 J1#4.11 ; port CON.LIN_R
NetJ3#2_2: J3#2.2 ; port CON.LOUT_L
NetJ3#2_3: J3#2.3 ; port CON.LOUT_R
NetJ4_2: J4.2 ; port CON.HP_L
NetJ4_3: J4.3 ; port CON.HP_R
NetJ4_11: J4.11 ; port CON.HP_SENSE
NetJ5_2: J5.2 J5.10 ; port CON.AMP_L
NetJ5_3: J5.3 J5.11 ; port CON.AMP_R

Not connected (* = marked no-connect by the designer): J3#2 10* 11*; J4 10*

### Notes on the sheet
- (near J1#4) Line In
- LINEIN R
- LINEIN L
- (near J3#2) Line Out
- (near J4) Headphone Out
- HEADPHONE R
- HEADPHONE L
- HEADPHONE SENSE
- (near J5) Amplifier Test
- AMPTEST R
- AMPTEST L
- Sheet Title
- Project Title
- Size:
- Date:
- A4
- Assy:
- Time:
- Revision:
- Sheet
- of
- File:

### Library data of the parts
J1#4 J5 = D-300-0033: Connector, 3.5mm Stereo Audio Socket, Black, 2 break contacts (normals) and 2 auxiliary make contacts; Category: Connector; Connector type: AUDIO BLACK HEADER; Status: Production
J3#2 = D-300-0031: Connector, 3.5mm Stereo Audio Socket, Green, 2 break contacts (normals) and 2 auxiliary make contacts; Category: Connector; Connector type: AUDIO GREEN HEADER; Status: Production
J4 = D-300-0032: Connector, 3.5mm Stereo Audio Socket, Blue, 2 break contacts (normals) and 2 auxiliary make contacts; Category: Connector; Connector type: AUDIO BLUE HEADER; Status: Production

## Sheet CON_FFC40_LCDTFT.SCHDOC: LCD Module Connector
size A4; DocumentNumber: 63; Revision: 01; SheetNumber: 64; SheetTotal: 78
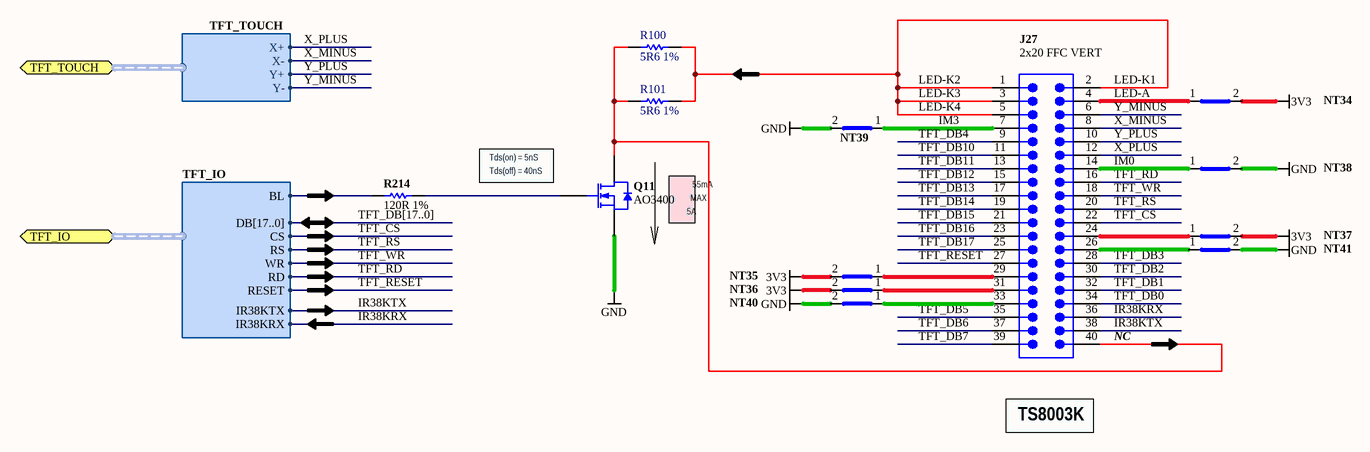
[diagram p23: CON_FFC40_LCDTFT.SCHDOC]

### Parts
J27  2x20 FFC VERT  [FPC-xxS1VN3R]
NT34  Net Tie SMT2  [NETTIE-SMT2-8X8]  (value not drawn)  (net tie, no BOM)
NT35  Net Tie SMT2  [NETTIE-SMT2-8X8]  (value not drawn)  (net tie, no BOM)
NT36  Net Tie SMT2  [NETTIE-SMT2-8X8]  (value not drawn)  (net tie, no BOM)
NT37  Net Tie SMT2  [NETTIE-SMT2-8X8]  (value not drawn)  (net tie, no BOM)
NT38  Net Tie SMT2  [NETTIE-SMT2-8X8]  (value not drawn)  (net tie, no BOM)
NT39  Net Tie SMT2  [NETTIE-SMT2-8X8]  (value not drawn)  (net tie, no BOM)
NT40  Net Tie SMT2  [NETTIE-SMT2-8X8]  (value not drawn)  (net tie, no BOM)
NT41  Net Tie SMT2  [NETTIE-SMT2-8X8]  (value not drawn)  (net tie, no BOM)
Q11  AO3400  [SOT95P230-3D]
R100  5R6 1%  [RESC1005-STAR]
R101  5R6 1%  [RESC1005-STAR]
R214  120R 1%  [RESC1005-STAR]

### Ports
TFT_IO (harness TFT_IO), TFT_TOUCH (harness TFT_TOUCH)

### Harnesses
TFT_IO: CS, RS, WR, RD, RESET, DB[17..0], BL, IR38KTX, IR38KRX
TFT_TOUCH: X+, X-, Y+, Y-

### Nets
3V3: NT34.2(Net2) NT35.2(Net2) NT36.2(Net2) NT37.2(Net2)
GND: NT38.2(Net2) NT39.2(Net2) NT40.2(Net2) NT41.2(Net2) Q11.3(S)
IR38KRX: J27.36 ; port TFT_IO.IR38KRX
IR38KTX: J27.38 ; port TFT_IO.IR38KTX
TFT_CS: J27.22 ; port TFT_IO.CS
TFT_DB0: J27.34
TFT_DB1: J27.32
TFT_DB2: J27.30
TFT_DB3: J27.28
TFT_DB4: J27.9
TFT_DB5: J27.35
TFT_DB6: J27.37
TFT_DB7: J27.39
TFT_DB10: J27.11
TFT_DB11: J27.13
TFT_DB12: J27.15
TFT_DB13: J27.17
TFT_DB14: J27.19
TFT_DB15: J27.21
TFT_DB16: J27.23
TFT_DB17: J27.25
TFT_RD: J27.16 ; port TFT_IO.RD
TFT_RESET: J27.27 ; port TFT_IO.RESET
TFT_RS: J27.20 ; port TFT_IO.RS
TFT_WR: J27.18 ; port TFT_IO.WR
X_MINUS: J27.8 ; port TFT_TOUCH.X-
X_PLUS: J27.12 ; port TFT_TOUCH.X+
Y_MINUS: J27.6 ; port TFT_TOUCH.Y-
Y_PLUS: J27.10 ; port TFT_TOUCH.Y+
NetJ27_1: J27.1 J27.2 J27.3 J27.5 R100.1 R101.1
NetJ27_4: J27.4 NT34.1(Net1)
NetJ27_7: J27.7 NT39.1(Net1)
NetJ27_14: J27.14 NT38.1(Net1)
NetJ27_24: J27.24 NT37.1(Net1)
NetJ27_26: J27.26 NT41.1(Net1)
NetJ27_29: J27.29 NT35.1(Net1)
NetJ27_31: J27.31 NT36.1(Net1)
NetJ27_33: J27.33 NT40.1(Net1)
NetJ27_40: J27.40 Q11.2(D) R100.2 R101.2
NetQ11_1: Q11.1(G) R214.1
NetR214_2: R214.2 ; port TFT_IO.BL

### Buses and harness runs
bus TFT_DB[17..0]

### Notes on the sheet
- LED-K3
- LED-K2
- LED-K4
- (near NT39) IM3
- LED-K1
- LED-A
- (near Q11) Tds(on) = 5nS
- (near Q11) Tds(off) = 40nS
- 55mA
- (near J27) IM0
- 5A
- MAX
- (near J27) NC
- TS8003K
- Sheet Title
- Project Title
- Size:
- Date:
- A4
- Assy:
- Time:
- Revision:
- Sheet
- of
- File:

### Library data of the parts
J27 = D-300-0125: Header FFC, 2x20 pin Vertical, 0.5mm; Connector type: Straight; Max Current: mA; Mounting Technology: Surface Mount; Pin Count: 40; Status: Unreleased; Category: Connector
NT34-NT41 = D-002-0003: as NT1#3 on sheet USB_CY7C68001-56LFC; Category: Net-Tie; Status: Production
Q11 = D-158-0005: N-channel Enhancement Mode Field-effect Transistor;  5.8A/30V; Transistor Type: NPN; Mounting Technology: Surface Mount; Status: Unreleased; Category: Transistor-FET
R100 R101 = D-100-0085: Resistor, 5R6 1% 0402 (1005); Power Rating: 63mW; Resistance: 5.6R; Category: Resistor; Mounting Technology: Surface Mount; Status: Production; Tolerance: 1%
R214 = D-100-0126: Resistor, 120R 1% 0402 (1005); Power Rating: 63 mW; Category: Resistor; Mounting Technology: Surface Mount; Resistance: 120 R; Status: Production; Tolerance: 1 %